# EAGLE design RedFive (EAGLE 9.1.0)

## Sheet 1 of 2
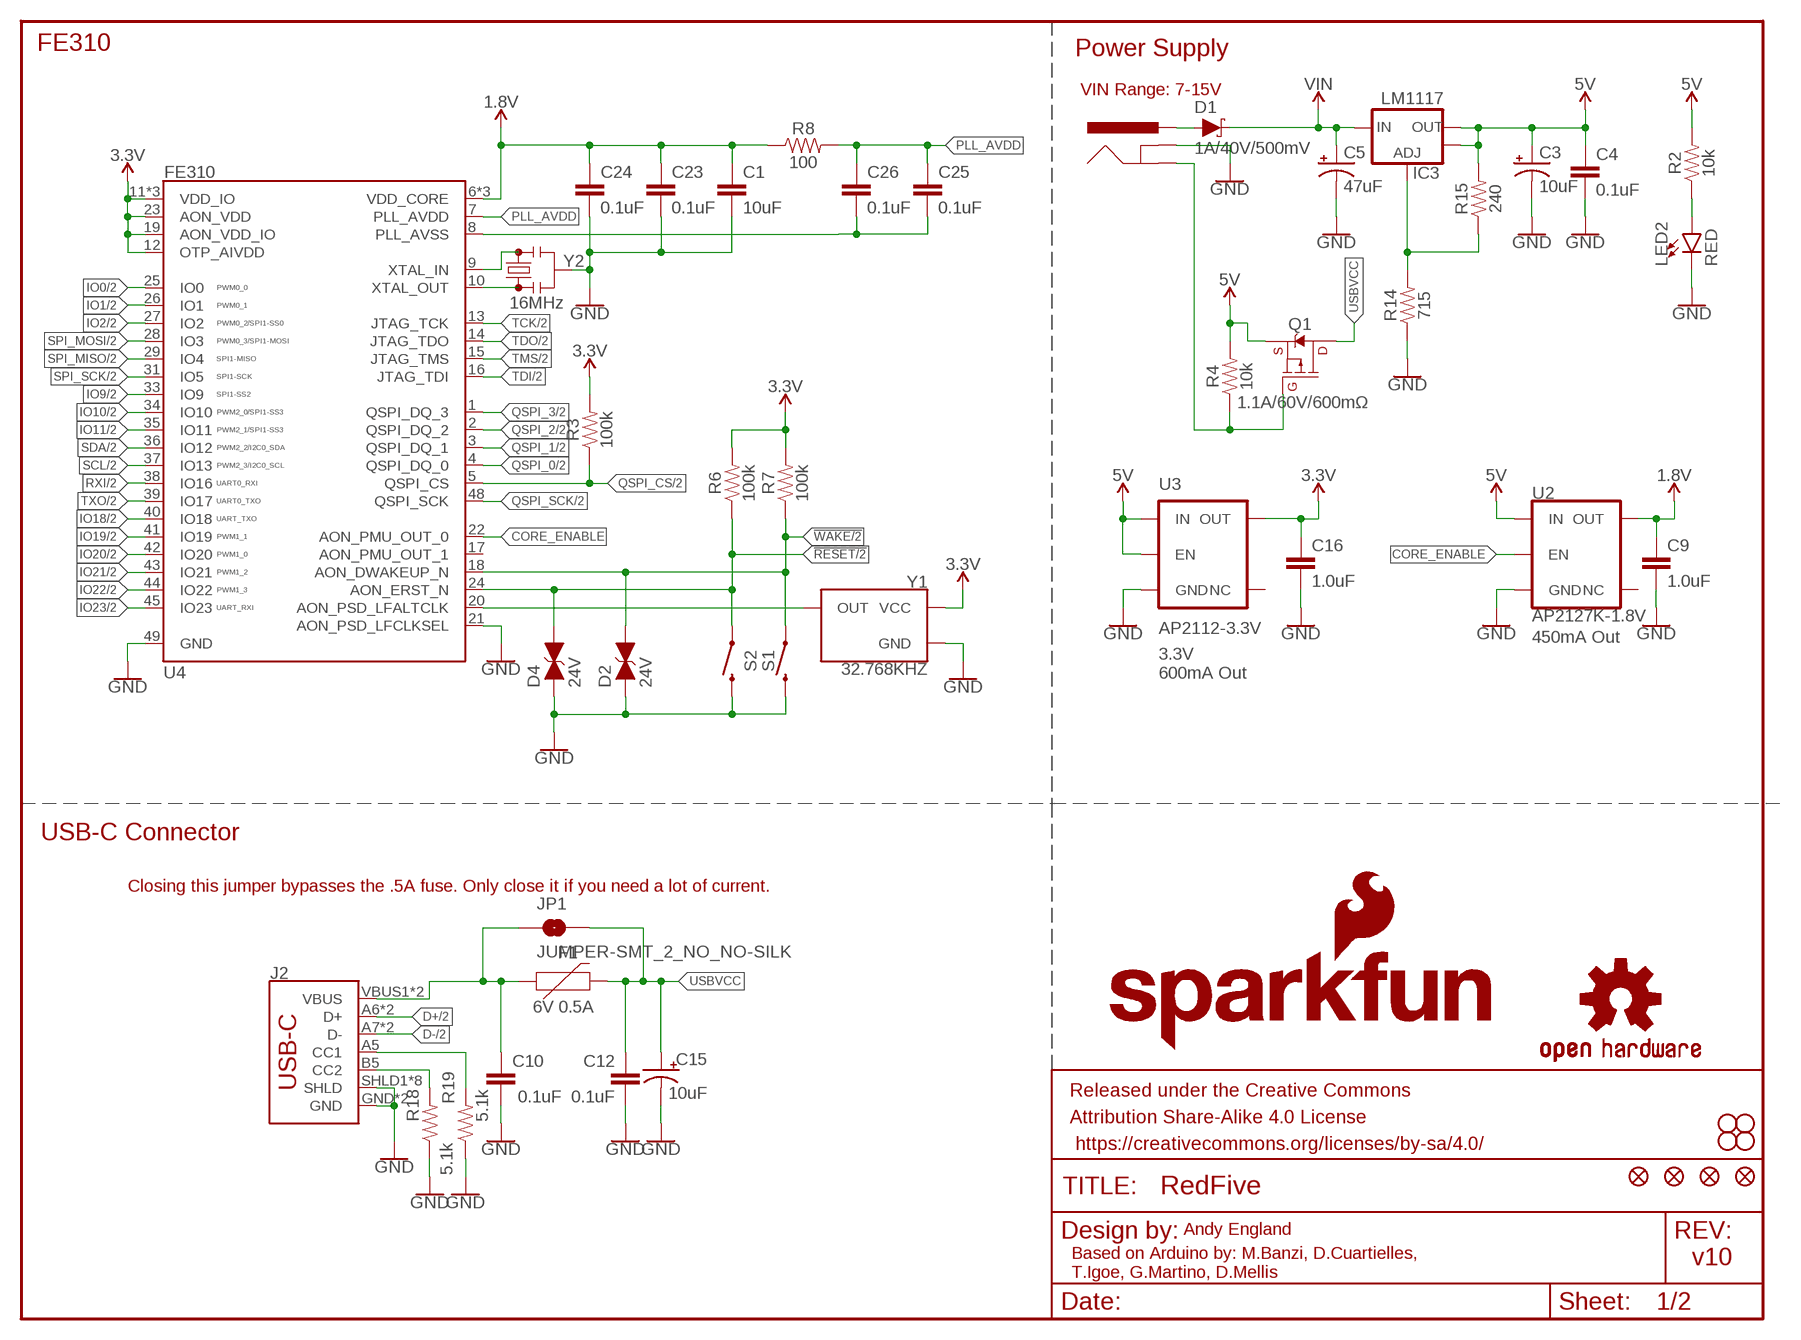
[diagram p0: schematic, sheet 1]

### Parts
C1  10uF  10UF-0603-6.3V-20%  [0603]
C3  10uF  10UF-POLAR-EIA3216-16V-10%(TANT)  [EIA3216]
C4  0.1uF  0.1UF-0603-25V-(+80/-20%)  [0603]
C5  47uF  47UF-POLAR-PANASONIC_D-35V-20%  [PANASONIC_D]
C9  1.0uF  1.0UF-0603-16V-10%  [0603]
C10  0.1uF  0.1UF-0603-25V-(+80/-20%)  [0603]
C12  0.1uF  0.1UF-0603-25V-(+80/-20%)  [0603]
C15  10uF  10UF-POLAR-EIA3216-16V-10%(TANT)  [EIA3216]
C16  1.0uF  1.0UF-0603-16V-10%  [0603]
C23  0.1uF  0.1UF-0603-25V-(+80/-20%)  [0603]
C24  0.1uF  0.1UF-0603-25V-(+80/-20%)  [0603]
C25  0.1uF  0.1UF-0603-25V-(+80/-20%)  [0603]
C26  0.1uF  0.1UF-0603-25V-(+80/-20%)  [0603]
D1  1A/40V/500mV  DIODE-SCHOTTKY-SS14  [SMA-DIODE]
D2  24V  DIODE_TVS  [0603]
D4  24V  DIODE_TVS  [0603]
F1  6V 0.5A  PPTC_6V500MA  [0805]
FRAME2  FRAME-LETTER  [CREATIVE_COMMONS]
IC3  LM1117  V_REG_LM1117ALT1  [SOT223-ALT1]
J2  USB Female Type C Connector  USB_C2-LAYER  [USB-C-16P]
J3  POWER_JACKSUPER_BOMB_DIGITY  [POWER_JACK_SMD_OVERPASTE_SUPER_BOMB_DIGITY]
JP1  JUMPER-SMT_2_NO_NO-SILK  [SMT-JUMPER_2_NO_NO-SILK]
JP3  STAND-OFF  [STAND-OFF]
JP4  STAND-OFF  [STAND-OFF]
JP5  STAND-OFF  [STAND-OFF]
JP6  STAND-OFF  [STAND-OFF]
JP8  FIDUCIAL1X2  [FIDUCIAL-1X2]
JP9  FIDUCIAL1X2  [FIDUCIAL-1X2]
JP15  FIDUCIAL1X2  [FIDUCIAL-1X2]
JP16  FIDUCIAL1X2  [FIDUCIAL-1X2]
LED2  RED  LED-RED1206  [LED-1206]
LOGO1  SFE_LOGO_NAME_FLAME.1_INCH  [SFE_LOGO_NAME_FLAME_.1]
Q1  1.1A/60V/600mΩ  MOSFET_PCH-SI2309DS  [SOT23-3]
R2  10k  10KOHM-0603-1/10W-1%  [0603]
R3  100k  100KOHM-0603-1/10W-1%  [0603]
R4  10k  10KOHM-0603-1/10W-1%  [0603]
R6  100k  100KOHM-0603-1/10W-1%  [0603]
R7  100k  100KOHM-0603-1/10W-1%  [0603]
R8  100  100OHM-0603-1/10W-1%  [0603]
R14  715  715OHM-0603-1/10W-1%  [0603]
R15  240  240OHM-0603-1/10W-1%  [0603]
R18  5.1k  5.1KOHM5.1KOHM-0603-1/10W-1%  [0603]
R19  5.1k  5.1KOHM5.1KOHM-0603-1/10W-1%  [0603]
S1  MOMENTARY-SWITCH-SPST-SMD-6.2MM-TALL  [TACTILE_SWITCH_SMD_6.2MM_TALL]
S2  MOMENTARY-SWITCH-SPST-SMD-6.2MM-TALL  [TACTILE_SWITCH_SMD_6.2MM_TALL]
U2  AP2127K-1.8V  V_REG_AP2127K-1.8V  [SOT23-5]
U3  AP2112-3.3V  V_REG_AP2112K-3.3V  [SOT23-5]
U4  FE310  SIFIVE_FE310  [QFN-48-.4MMPITCH]
U$16  OSHW-LOGOS  [OSHW-LOGO-S]
Y1  32.768KHZ  SITIME-CRYSTAL-32.768KHZ  [CRYSTAL-SMD-2X1.2MM]
Y2  16MHz  RESONATOR-16MHZSMD_3.2X1.3  [RESONATOR-SMD-3.2X1.3]

### Nets
1.8V: C1.1 C9.1 C23.1 C24.1 R8.1 U2.5(OUT) U4.6(VDD_CORE) U4.30(VDD_CORE) U4.46(VDD_CORE)
3.3V: C16.1 R3.2 R6.2 R7.2 U3.5(OUT) U4.11(VDD_IO) U4.12(OTP_AIVDD) U4.19(AON_VDD_IO) U4.23(AON_VDD) U4.32(VDD_IO) U4.47(VDD_IO) Y1.4(VCC) ; also sheet 2
5V: C3.+ C4.1 IC3.2(OUT) IC3.4(OUT) Q1.2(S) R2.2 R4.2 R15.2 U2.1(IN) U3.1(IN) U3.3(EN) ; also sheet 2
!RESET: D4.2(C) R6.1 S2.A2 U4.24(AON_ERST_N) ; also sheet 2
!WAKE: D2.2(C) R7.1 S1.A2 U4.18(AON_DWAKEUP_N) ; also sheet 2
CORE_ENABLE: U2.3(EN) U4.22(AON_PMU_OUT_0)
D+: J2.A6(D+) J2.B6(D+) ; also sheet 2
D-: J2.A7(D-) J2.B7(D-) ; also sheet 2
GND: C1.2 C3.- C4.2 C5.- C9.2 C10.2 C12.2 C15.- C16.2 C23.2 C24.2 D2.1(A) D4.1(A) J2.GND J2.GND2(GND) J2.SHLD1(SHLD) J2.SHLD2(SHLD) J2.SHLD3(SHLD) J2.SHLD4(SHLD) J2.SHLD5(SHLD) J2.SHLD6(SHLD) J2.SHLD7(SHLD) J2.SHLD8(SHLD) J3.GND(GNDBREAK) LED2.C R14.1 R18.1 R19.1 S1.B2 S2.B2 U2.2(GND) U3.2(GND) U4.21(AON_PSD_LFCLKSEL) U4.49(GND) Y1.2(GND) Y2.2 ; also sheet 2
INSERT: J3.P$4(GND) Q1.1(G) R4.1
IO0: U4.25(IO0) ; also sheet 2
IO1: U4.26(IO1) ; also sheet 2
IO2: U4.27(IO2) ; also sheet 2
IO9: U4.33(IO9) ; also sheet 2
IO10: U4.34(IO10) ; also sheet 2
IO11: U4.35(IO11) ; also sheet 2
IO18: U4.40(IO18) ; also sheet 2
IO19: U4.41(IO19) ; also sheet 2
IO20: U4.42(IO20) ; also sheet 2
IO21: U4.43(IO21) ; also sheet 2
IO22: U4.44(IO22) ; also sheet 2
IO23: U4.45(IO23) ; also sheet 2
N$2: LED2.A R2.1
N$3: U4.10(XTAL_OUT) Y2.1
N$7: U4.9(XTAL_IN) Y2.3
N$8: U4.20(AON_PSD_LFALTCLK) Y1.3(OUT)
N$10: C25.2 C26.2 U4.8(PLL_AVSS)
N$12: J2.B5(CC2) R18.2
N$15: IC3.1(ADJ) R14.2 R15.1
N$17: J2.A5(CC1) R19.2
PLL_AVDD: C25.1 C26.1 R8.2 U4.7(PLL_AVDD)
PWRIN: D1.A J3.VIN0(PWR)
QSPI_0: U4.4(QSPI_DQ_0) ; also sheet 2
QSPI_1: U4.3(QSPI_DQ_1) ; also sheet 2
QSPI_2: U4.2(QSPI_DQ_2) ; also sheet 2
QSPI_3: U4.1(QSPI_DQ_3) ; also sheet 2
QSPI_CS: R3.1 U4.5(QSPI_CS) ; also sheet 2
QSPI_SCK: U4.48(QSPI_SCK) ; also sheet 2
RXI: U4.38(IO16) ; also sheet 2
SCL: U4.37(IO13) ; also sheet 2
SDA: U4.36(IO12) ; also sheet 2
SPI_MISO: U4.29(IO4) ; also sheet 2
SPI_MOSI: U4.28(IO3) ; also sheet 2
SPI_SCK: U4.31(IO5) ; also sheet 2
TCK: U4.13(JTAG_TCK) ; also sheet 2
TDI: U4.16(JTAG_TDI) ; also sheet 2
TDO: U4.14(JTAG_TDO) ; also sheet 2
TMS: U4.15(JTAG_TMS) ; also sheet 2
TXO: U4.39(IO17) ; also sheet 2
USBVCC: C12.1 C15.+ F1.2 JP1.2 Q1.3(D)
VIN: C5.+ D1.C IC3.3(IN) ; also sheet 2
VUSB: C10.1 F1.1 J2.VBUS1(VBUS) J2.VBUS2(VBUS) JP1.1
Unconnected: U2.4(NC) U3.4(NC) U4.17(AON_PMU_OUT_1)

### Notes on the sheet
- FE310 | Power Supply
- VIN Range: 7-15V
- 450mA Out
- 3.3V
  600mA Out
- USB-C Connector
- Closing this jumper bypasses the .5A fuse. Only close it if you need a lot of current.
- Andy England
- v10
- Based on Arduino by: M.Banzi, D.Cuartielles, 
  T.Igoe, G.Martino, D.Mellis

## Sheet 2 of 2
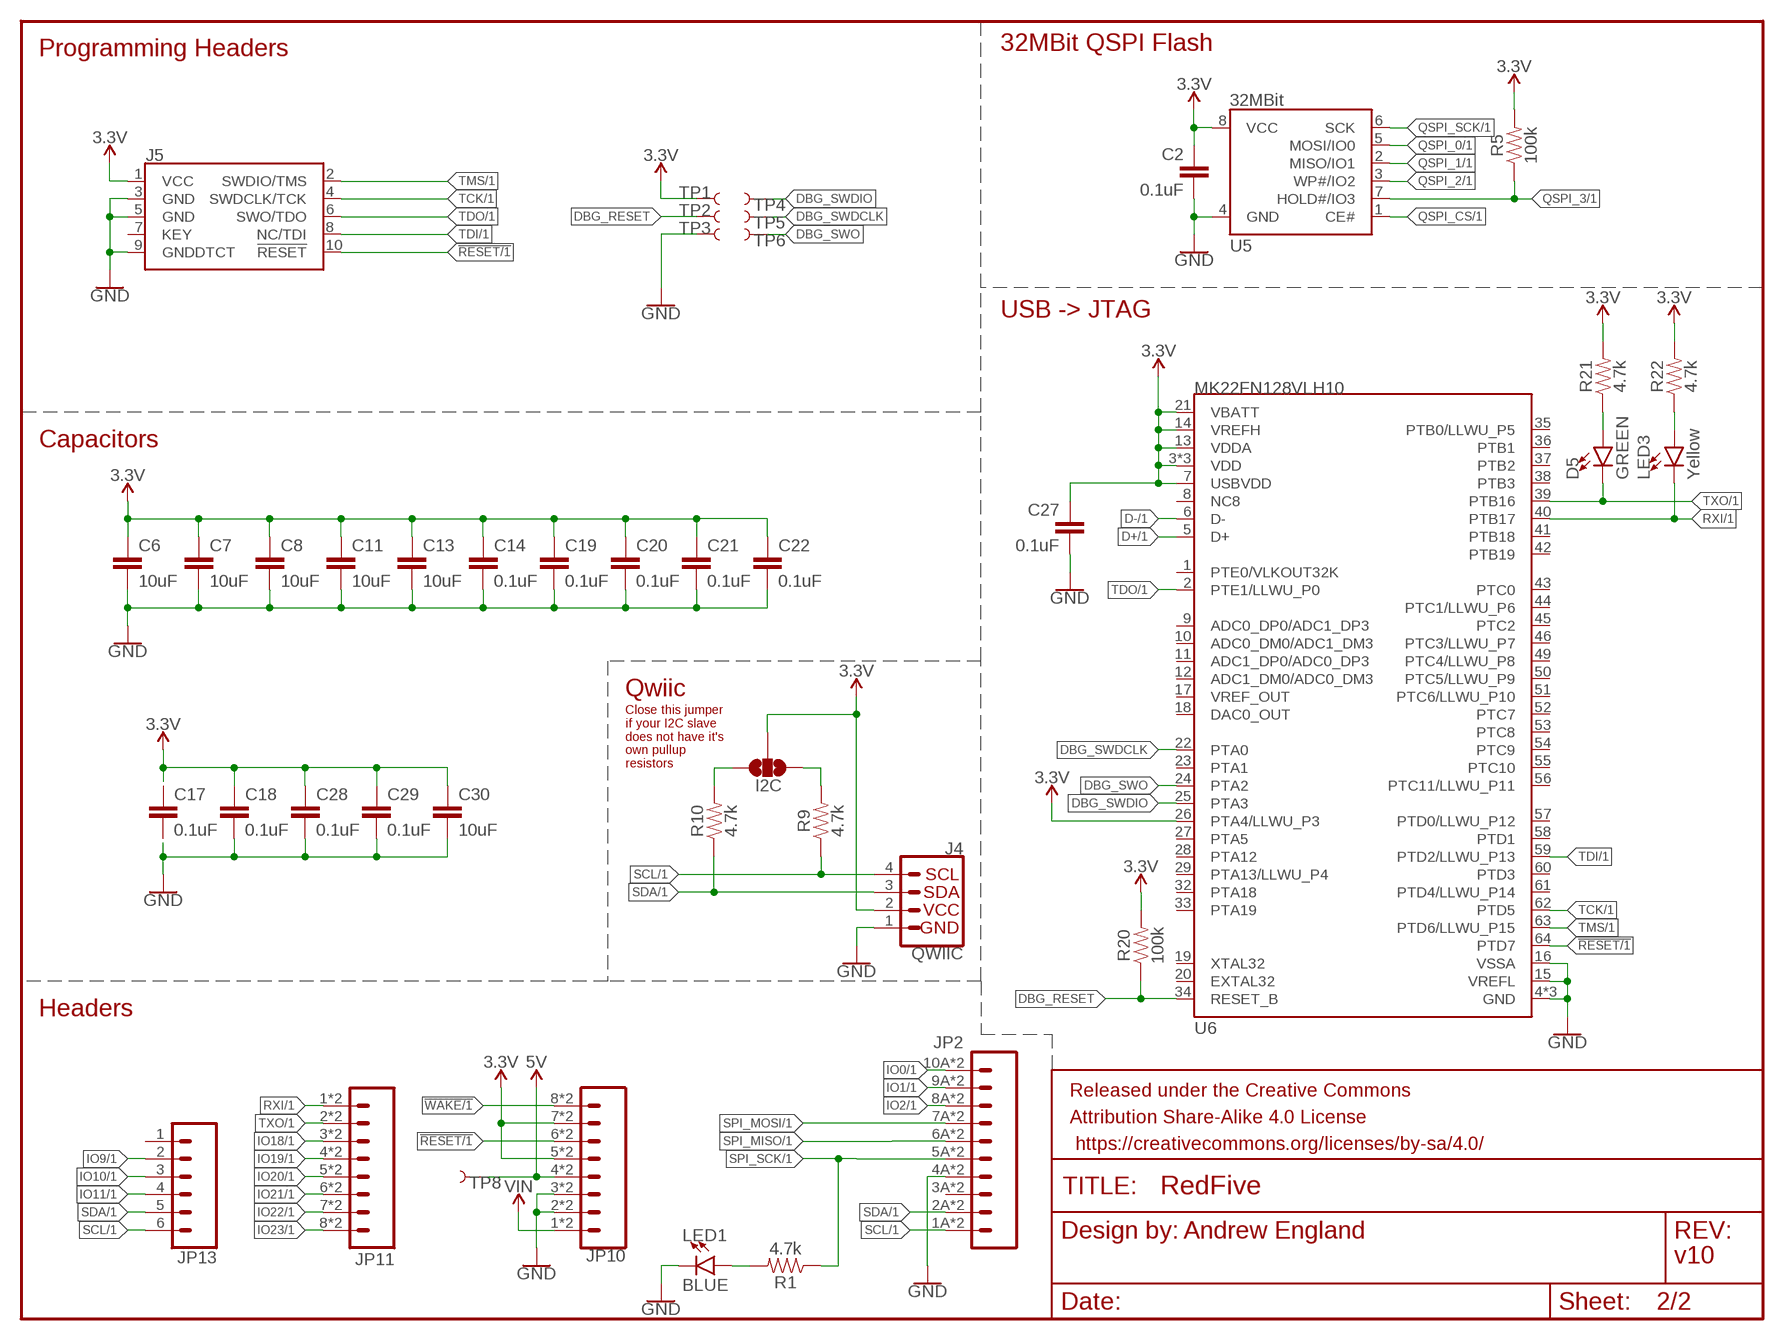
[diagram p1: schematic, sheet 2]

### Parts
C2  0.1uF  0.1UF-0603-25V-(+80/-20%)  [0603]
C6  10uF  10UF-0603-6.3V-20%  [0603]
C7  10uF  10UF-0603-6.3V-20%  [0603]
C8  10uF  10UF-0603-6.3V-20%  [0603]
C11  10uF  10UF-0603-6.3V-20%  [0603]
C13  10uF  10UF-0603-6.3V-20%  [0603]
C14  0.1uF  0.1UF-0603-25V-(+80/-20%)  [0603]
C17  0.1uF  0.1UF-0603-25V-(+80/-20%)  [0603]
C18  0.1uF  0.1UF-0603-25V-(+80/-20%)  [0603]
C19  0.1uF  0.1UF-0603-25V-(+80/-20%)  [0603]
C20  0.1uF  0.1UF-0603-25V-(+80/-20%)  [0603]
C21  0.1uF  0.1UF-0603-25V-(+80/-20%)  [0603]
C22  0.1uF  0.1UF-0603-25V-(+80/-20%)  [0603]
C27  0.1uF  0.1UF-0603-25V-(+80/-20%)  [0603]
C28  0.1uF  0.1UF-0603-25V-(+80/-20%)  [0603]
C29  0.1uF  0.1UF-0603-25V-(+80/-20%)  [0603]
C30  10uF  10UF-0603-6.3V-20%  [0603]
D5  GREEN  LED-GREENLILYPAD  [LED-1206]
FRAME1  FRAME-LETTER  [CREATIVE_COMMONS]
I2C  JUMPER-SMT_3_NO_NO-SILK  [SMT-JUMPER_3_NO_NO-SILK]
J4  QWIIC  QWIIC_CONNECTORJS-1MM  [JST04_1MM_RA]
J5  CORTEX_JTAG_DEBUG_PTH_NS  [2X5-PTH-1.27MM-NO_SILK]
JP2  CONN_10SMD_COMBO-FEMALE  [1X10_SMD_COMBINED]
JP10  CONN_08SMD-COMBO-FEMALE  [1X08_SMD_COMBINED]
JP11  JP11  CONN_08SMD-COMBO-FEMALE  [1X08_SMD_COMBINED]
JP13  CONN_06SMD-STRAIGHT-COMBO-FEMALE  [1X06_SMD_STRAIGHT_COMBO]
LED1  BLUE  LED-BLUE1206  [LED-1206]
LED3  Yellow  LED-YELLOWLILYPAD  [LED-1206]
R1  4.7k  4.7KOHM-0603-1/10W-1%  [0603]
R5  100k  100KOHM-0603-1/10W-1%  [0603]
R9  4.7k  4.7KOHM-0603-1/10W-1%  [0603]
R10  4.7k  4.7KOHM-0603-1/10W-1%  [0603]
R20  100k  100KOHM-0603-1/10W-1%  [0603]
R21  4.7k  4.7KOHM-0603-1/10W-1%  [0603]
R22  4.7k  4.7KOHM-0603-1/10W-1%  [0603]
TP1  TEST-POINT3X5  [PAD.03X.05]
TP2  TEST-POINT3X5  [PAD.03X.05]
TP3  TEST-POINT3X5  [PAD.03X.05]
TP4  TEST-POINT3X5  [PAD.03X.05]
TP5  TEST-POINT3X5  [PAD.03X.05]
TP6  TEST-POINT3X5  [PAD.03X.05]
TP8  TEST-POINT3  [PAD.03X.03]
U5  32MBit  QSPI32MBIT  [SO08]
U6  MK22FN128VLH10  [LQFP-64]

### Nets
3.3V: C2.1 C6.1 C7.1 C8.1 C11.1 C13.1 C14.1 C17.1 C18.1 C19.1 C20.1 C21.1 C22.1 C27.1 C28.1 C29.1 C30.1 I2C.2 J4.2 J5.1(VCC) JP10.5 JP10.5@2 JP10.7 JP10.7@2 R5.2 R20.2 R21.2 R22.2 TP1.P$1 U5.8(VCC) U6.3(VDD) U6.7(USBVDD) U6.13(VDDA) U6.14(VREFH) U6.21(VBATT) U6.26(PTA4/LLWU_P3) U6.30(VDD) U6.48(VDD) ; also sheet 1
5V: JP10.4 JP10.4@2 TP8.P$1 ; also sheet 1
!RESET: J5.10(!RESET) JP10.6 JP10.6@2 U6.64(PTD7) ; also sheet 1
!WAKE: JP10.8 JP10.8@2 ; also sheet 1
D+: U6.5(D+) ; also sheet 1
D-: U6.6(D-) ; also sheet 1
DBG_RESET: R20.1 TP2.P$1 U6.34(RESET_B)
DBG_SWDCLK: TP5.P$1 U6.22(PTA0)
DBG_SWDIO: TP4.P$1 U6.25(PTA3)
DBG_SWO: TP6.P$1 U6.24(PTA2)
GND: C2.2 C6.2 C7.2 C8.2 C11.2 C13.2 C14.2 C17.2 C18.2 C19.2 C20.2 C21.2 C22.2 C27.2 C28.2 C29.2 C30.2 J4.1 J5.3(GND) J5.5(GND) J5.9(GNDDTCT) JP2.4A JP2.4B JP10.2 JP10.2@2 JP10.3 JP10.3@2 LED1.C TP3.P$1 U5.4(GND) U6.4(GND) U6.15(VREFL) U6.16(VSSA) U6.31(GND) U6.47(GND) ; also sheet 1
IO0: JP2.10A JP2.10B ; also sheet 1
IO1: JP2.9A JP2.9B ; also sheet 1
IO2: JP2.8A JP2.8B ; also sheet 1
IO9: JP13.2 ; also sheet 1
IO10: JP13.3 ; also sheet 1
IO11: JP13.4 ; also sheet 1
IO18: JP11.3 JP11.3@2 ; also sheet 1
IO19: JP11.4 JP11.4@2 ; also sheet 1
IO20: JP11.5 JP11.5@2 ; also sheet 1
IO21: JP11.6 JP11.6@2 ; also sheet 1
IO22: JP11.7 JP11.7@2 ; also sheet 1
IO23: JP11.8 JP11.8@2 ; also sheet 1
N$1: LED1.A R1.2
N$4: I2C.3 R10.2
N$5: I2C.1 R9.2
N$6: LED3.A R22.1
N$13: D5.A R21.1
QSPI_0: U5.5(MOSI/IO0) ; also sheet 1
QSPI_1: U5.2(MISO/IO1) ; also sheet 1
QSPI_2: U5.3(WP#/IO2) ; also sheet 1
QSPI_3: R5.1 U5.7(HOLD#/IO3) ; also sheet 1
QSPI_CS: U5.1(CE#) ; also sheet 1
QSPI_SCK: U5.6(SCK) ; also sheet 1
RXI: JP11.1 JP11.1@2 LED3.C U6.40(PTB17) ; also sheet 1
SCL: J4.4 JP2.1A JP2.1B JP13.6 R9.1 ; also sheet 1
SDA: J4.3 JP2.2A JP2.2B JP13.5 R10.1 ; also sheet 1
SPI_MISO: JP2.6A JP2.6B ; also sheet 1
SPI_MOSI: JP2.7A JP2.7B ; also sheet 1
SPI_SCK: JP2.5A JP2.5B R1.1 ; also sheet 1
TCK: J5.4(SWDCLK/TCK) U6.62(PTD5) ; also sheet 1
TDI: J5.8(NC/TDI) U6.59(PTD2/LLWU_P13) ; also sheet 1
TDO: J5.6(SWO/TDO) U6.2(PTE1/LLWU_P0) ; also sheet 1
TMS: J5.2(SWDIO/TMS) U6.63(PTD6/LLWU_P15) ; also sheet 1
TXO: D5.C JP11.2 JP11.2@2 U6.39(PTB16) ; also sheet 1
VIN: JP10.1 JP10.1@2 ; also sheet 1
Unconnected: J5.7(KEY) JP2.3A JP2.3B JP13.1 U6.1(PTE0/VLKOUT32K) U6.8(NC8) U6.9(ADC0_DP0/ADC1_DP3) U6.10(ADC0_DM0/ADC1_DM3) U6.11(ADC1_DP0/ADC0_DP3) U6.12(ADC1_DM0/ADC0_DM3) U6.17(VREF_OUT) U6.18(DAC0_OUT) U6.19(XTAL32) U6.20(EXTAL32) U6.23(PTA1) U6.27(PTA5) U6.28(PTA12) U6.29(PTA13/LLWU_P4) U6.32(PTA18) U6.33(PTA19) U6.35(PTB0/LLWU_P5) U6.36(PTB1) U6.37(PTB2) U6.38(PTB3) U6.41(PTB18) U6.42(PTB19) U6.43(PTC0) U6.44(PTC1/LLWU_P6) U6.45(PTC2) U6.46(PTC3/LLWU_P7) U6.49(PTC4/LLWU_P8) U6.50(PTC5/LLWU_P9) U6.51(PTC6/LLWU_P10) U6.52(PTC7) U6.53(PTC8) U6.54(PTC9) U6.55(PTC10) U6.56(PTC11/LLWU_P11) U6.57(PTD0/LLWU_P12) U6.58(PTD1) U6.60(PTD3) U6.61(PTD4/LLWU_P14)

### Notes on the sheet
- Programming Headers | 32MBit QSPI Flash
- USB -> JTAG
- Capacitors
- Qwiic
- Close this jumper 
  if your I2C slave 
  does not have it's
  own pullup 
  resistors
- Headers
- Andrew England
- v10

## Library data of the parts
C1 C6-C8 C11 C13 C30 = SparkFun-Capacitors:10UF: 10.0µF ceramic capacitors A capacitor is a passive two-terminal electrical component used to store electrical energy temporarily in an electric field.; PROD_ID: CAP-11015
C2 C4 C10 C12 C14 C17-C29 = SparkFun-Capacitors:0.1UF: 0.1µF ceramic capacitors A capacitor is a passive two-terminal electrical component used to store electrical energy temporarily in an electric field.; PROD_ID: CAP-00810
C3 C15 = SparkFun-Capacitors:10UF-POLAR: 10.0µF polarized capacitors A capacitor is a passive two-terminal electrical component used to store electrical energy temporarily in an electric field.; PROD_ID: CAP-00811
C5 = SparkFun-Capacitors:47UF-POLAR: 47µF polarized capacitors A capacitor is a passive two-terminal electrical component used to store electrical energy temporarily in an electric field.; PROD_ID: CAP-08478
C9 C16 = SparkFun-Capacitors:1.0UF: 1µF ceramic capacitors A capacitor is a passive two-terminal electrical component used to store electrical energy temporarily in an electric field.; PROD_ID: CAP-00868
D1 = SparkFun-DiscreteSemi:DIODE-SCHOTTKY: Schottky diode A Schottky diode is a semiconductor diode which has a low forward voltage drop and a very fast switching action.; PROD_ID: DIO-08053
D2 D4 = SparkFun-DiscreteSemi:DIODE_TVS; PROD_ID: DIO-14502
D5 = SparkFun-LED:LED-GREEN: Green SMD LED Used in manufacturing of various products at SparkFun Packages: 0603 - SMD 0603 package [Product Link] <http://www.futureelectronics.com/en/technologies/semiconductors/optoelectronics/leds/Pages/9894312-LTST-C190GKT.aspx?CrossPart=HSMG-C190&IM=0> LilyPad 1206 - SMD1206 LilyPad package [Product Link] <http://www.futureelectronics.com/en/Technologies/Product.aspx?ProductID=IN150NGHARVATEKCORPORATION2049943&IM=0> 1206 - SMD1206 package [Product Link] <http://www.futureelectronics.com/en/technologies/semiconductors/optoelectronics/leds/Pages/8315665-LTST-C150KGKT.aspx?IM=0> 1206 Bottom Mount -SMD 1206 Bottom Mount [Product Link] <http://www.digikey.com/product-detail/en/lite-on-inc/LTST-C230KGKT/160-1456-1-ND/386854> SparkFun Products: Pro Mini 328 -5V <https://www.sparkfun.com/products/821> RedBoard <https://www.sparkfun.com/products/12757> MP3 Trigger <https://www.sparkfun.com/products/13720> Makey Makey <https://www.sparkfun.com/products/11076>; PROD_ID: DIO-09910
F1 = SparkFun-Fuses:PPTC: Resettable Fuse PPTC Resettable Fuse. Really a sort of resistor with a polymeric positive temperature coefficient whose resistance increases dramatically with an increase in temperature. When heated by the power passing through the resistance rises causing the current to be limited, protecting the circuit. This is achieved by the transition of the polymer from a crystalline to an amorphous state where the conductive carbon separates breaking the conductive pathways found in the cool crystalline structure. When a PPTC cools back down it resumes conducting letting the circuit turn back on. SparkFun Products: SparkFun RedBoard - Programmed with Arduino <https://www.sparkfun.com/products/12757> Pro Micro - 5V/16MHz <https://www.sparkfun.com/products/12640> Arduino Pro 328 - 5V/16MHz <https://www.sparkfun.com/products/10915> MP3 Trigger <https://www.sparkfun.com/products/13720>; PROD_ID: RES-13945
FRAME1 FRAME2 = SparkFun-Aesthetics:FRAME-LETTER: Schematic Frame - Letter Standard 8.5x11 US Letter frame
I2C = SparkFun-Jumpers:JUMPER-SMT_3_NO: Normally open jumper This jumper has three pads in close proximity to each other. Apply solder to close the connection(s).
IC3 = Testing:V_REG_LM1117: Voltage Regulator LM1117 Standard adjustable voltage regulator but in SMD form. Spark Fun Electronics SKU : COM-00595; PROD_ID: VREG-08170
J2 = SparkFun-Connectors:USB_C: USB Type C 16Pin Connector Super Speed pins not available on the 16-pin purely SMD connector so this part is best for USB 2.0 implementations. D1 and D2 are tied together enabling D+/- no matter which way the cable is plugged into the connector. The two channel configuration pins (CC1/2) are exposed. These are normally connected to ground via 5.1k resistors but can be reconfigured for high current/high power applications.; PROD_ID: CONN-14122
J3 = Testing:POWER_JACK: Power Jack This is the standard 5.5mm barrel jack for power. The PTH is the most common, proven, reliable, footprint. All others are experimental. The Slot footprint only works if the mill layer is transmitted to the PCB fab house so be warned. Spark Fun Electronics SKU : PRT-00119. Mating wall wart : TOL-00298 (and others); PROD_ID: CONN-08106
J4 = SparkFun-Connectors:QWIIC_CONNECTOR: SparkFun I2C Standard Qwiic Connector An SMD 1mm pitch JST connector makes it easy and quick (get it? Qwiic?) to connect I2C devices to each other. The Qwiic system <http://www.sparkfun.com/qwiic> enables fast and solderless connection between popular platforms and various sensors and actuators. We carry 200mm <https://www.sparkfun.com/products/14204>, 100mm <https://www.sparkfun.com/products/14205>, 50mm <https://www.sparkfun.com/products/14206>, and breadboard friendly <https://www.sparkfun.com/products/14207> Qwiic cables. We also offer 10 pcs strips <https://www.sparkfun.com/products/14323> the SMD connectors.; PROD_ID: CONN-13694; VALUE: QWIIC_RIGHT_ANGLE
J5 = SparkFun-Connectors:CORTEX_JTAG_DEBUG: Cortex Debug Connector - 10 pin Supports JTAG debug, Serial Wire debug, and Serial Wire Viewer. PTH and SMD connector options available. General Connector Information <http://infocenter.arm.com/help/topic/com.arm.doc.faqs/attached/13634/cortex_debug_connectors.pdf> Products: PTH Connector <http://www.digikey.com/product-detail/en/cnc-tech/3220-10-0100-00/1175-1627-ND/3883661> -via Digi-Key SparkFun PSoc <https://www.sparkfun.com/products/13229> SparkFun T <https://www.sparkfun.com/products/13810>
JP1 = SparkFun-Jumpers:JUMPER-SMT_2_NO: Normally open jumper This jumper has two pads in close proximity to each other. Apply solder to close the connection. Round pads are easier to solder for beginners, but are a lot larger. SparkFun Product that uses the round pads: SparkFun EL Sequencer <https://www.sparkfun.com/products/12781>
JP2 = SparkFun-Connectors:CONN_10: Multi connection point. Often used as Generic Header-pin footprint for 0.1 inch spaced/style header connections On any of the 0.1 inch spaced packages, you can populate with these: Break Away Headers - Straight <https://www.sparkfun.com/products/116> (PRT-00116) Break Away Male Headers - Right Angle <https://www.sparkfun.com/products/553> (PRT-00553) Female Headers <https://www.sparkfun.com/products/115> (PRT-00115) Break Away Headers - Machine Pin <https://www.sparkfun.com/products/117> (PRT-00117) Break Away Female Headers - Swiss Machine Pin <https://www.sparkfun.com/products/743> (PRT-00743) Arduino Stackable Header - 10 Pin <https://www.sparkfun.com/products/11376> (PRT-11376) For SCREWTERMINALS and SPRING TERMINALS visit here: Screw Terimnals on SparkFun.com <https://www.sparkfun.com/search/results?term=Screw+Terminals> (5mm/3.5mm/2.54mm spacing) This device is also useful as a general connection point to wire up your design to another part of your project. Our various solder wires solder well into these plated through hole pads. Hook-Up Wire - Assortment (Stranded, 22 AWG) <https://www.sparkfun.com/products/11375> (PRT-11375) Hook-Up Wire - Assortment (Solid Core, 22 AWG) <https://www.sparkfun.com/products/11367> (PRT-11367) View the entire wire category on our website here <https://www.sparkfun.com/categories/141> Special notes: Molex polarized connector foot print use with SKU : PRT-08231 with associated crimp pins and housings. 1MM SMD Version SKU: PRT-10208 NOTES ON THE VARIANTS LOCK and LOCK_LONGPADS... This footprint was designed to help hold the alignment of a through-hole component (i.e. 6-pin header) while soldering it into place. You may notice that each hole has been shifted either up or down by 0.005 of an inch from it's more standard position (which is a perfectly straight line). This slight alteration caused the pins (the squares in the middle) to touch the edges of the holes. Because they are alternating, it causes a "brace" to hold the component in place. 0.005 has proven to be the perfect amount of "off-center" position when using our standard breakaway headers. Although looks a little odd when you look at the bare footprint, once you have a header in there, the alteration is very hard to notice. Also,if you push a header all the way into place, it is covered up entirely on the bottom side.; PROD_ID: CONN-11219
JP3-JP6 = SparkFun:STAND-OFF: Stand Off This is the mechanical footprint for a #4 phillips button head screw. Use the keepout ring to avoid running the screw head into surrounding components. SKU : PRT-00447
JP8 JP9 JP15 JP16 = SparkFun:FIDUCIAL: Fiducial Alignment Points Various fiducial points for machine vision alignment.
JP10 JP11 = SparkFun-Connectors:CONN_08: Multi connection point. Often used as Generic Header-pin footprint for 0.1 inch spaced/style header connections On any of the 0.1 inch spaced packages, you can populate with these: Break Away Headers - Straight <https://www.sparkfun.com/products/116> (PRT-00116) Break Away Male Headers - Right Angle <https://www.sparkfun.com/products/553> (PRT-00553) Female Headers <https://www.sparkfun.com/products/115> (PRT-00115) Break Away Headers - Machine Pin <https://www.sparkfun.com/products/117> (PRT-00117) Break Away Female Headers - Swiss Machine Pin <https://www.sparkfun.com/products/743> (PRT-00743) Arduino Stackable Header - 8 Pin <https://www.sparkfun.com/products/9279> (PRT-09279) For SCREWTERMINALS and SPRING TERMINALS visit here: Screw Terimnals on SparkFun.com <https://www.sparkfun.com/search/results?term=Screw+Terminals> (5mm/3.5mm/2.54mm spacing) This device is also useful as a general connection point to wire up your design to another part of your project. Our various solder wires solder well into these plated through hole pads. Hook-Up Wire - Assortment (Stranded, 22 AWG) <https://www.sparkfun.com/products/11375> (PRT-11375) Hook-Up Wire - Assortment (Solid Core, 22 AWG) <https://www.sparkfun.com/products/11367> (PRT-11367) View the entire wire category on our website here <https://www.sparkfun.com/categories/141> Special notes: Molex polarized connector foot print use with SKU : PRT-08231 with associated crimp pins and housings. 1MM SMD Version SKU: PRT-10208 NOTES ON THE VARIANTS LOCK and LOCK_LONGPADS... This footprint was designed to help hold the alignment of a through-hole component (i.e. 6-pin header) while soldering it into place. You may notice that each hole has been shifted either up or down by 0.005 of an inch from it's more standard position (which is a perfectly straight line). This slight alteration caused the pins (the squares in the middle) to touch the edges of the holes. Because they are alternating, it causes a "brace" to hold the component in place. 0.005 has proven to be the perfect amount of "off-center" position when using our standard breakaway headers. Although looks a little odd when you look at the bare footprint, once you have a header in there, the alteration is very hard to notice. Also,if you push a header all the way into place, it is covered up entirely on the bottom side.; PROD_ID: CONN-10204; SF_ID: PRT-11543
JP13 = SparkFun-Connectors:CONN_06: Multi connection point. Often used as Generic Header-pin footprint for 0.1 inch spaced/style header connections On any of the 0.1 inch spaced packages, you can populate with these: Break Away Headers - Straight <https://www.sparkfun.com/products/116> (PRT-00116) Break Away Male Headers - Right Angle <https://www.sparkfun.com/products/553> (PRT-00553) Female Headers <https://www.sparkfun.com/products/115> (PRT-00115) Break Away Headers - Machine Pin <https://www.sparkfun.com/products/117> (PRT-00117) Break Away Female Headers - Swiss Machine Pin <https://www.sparkfun.com/products/743> (PRT-00743) Arduino Stackable Header - 6 Pin <https://www.sparkfun.com/products/9280> (PRT-09280) For SCREWTERMINALS and SPRING TERMINALS visit here: Screw Terimnals on SparkFun.com <https://www.sparkfun.com/search/results?term=Screw+Terminals> (5mm/3.5mm/2.54mm spacing) This device is also useful as a general connection point to wire up your design to another part of your project. Our various solder wires solder well into these plated through hole pads. Hook-Up Wire - Assortment (Stranded, 22 AWG) <https://www.sparkfun.com/products/11375> (PRT-11375) Hook-Up Wire - Assortment (Solid Core, 22 AWG) <https://www.sparkfun.com/products/11367> (PRT-11367) View the entire wire category on our website here <https://www.sparkfun.com/categories/141>; PROD_ID: CONN-10203
LED1 = SparkFun-LED:LED-BLUE: Blue SMD LED Used in manufacturing of various products at SparkFun Packages: 0603 - SMD 0603 package [Product Link] <http://www.digikey.com/product-detail/en/SMLE12BC7TT86/511-1589-2-ND/1641808> 1206 - SMD1206 package [Product Link] <http://www.digikey.com/product-detail/en/lite-on-inc/LTST-C150TBKT/160-1643-1-ND/573584> SparkFun Products: ESP8266 Thing-Dev Board <https://www.sparkfun.com/products/13711> RedBoard <https://www.sparkfun.com/products/12757>; PROD_ID: DIO-09911
LED2 = SparkFun-LED:LED-RED: Red SMD LED Used in manufacturing of most products at SparkFun Packages: 0603 - SMD 0603 package [Product Link] <http://docs.avagotech.com/docs/AV02-0551EN> 0603 SMART - SMD 0603 SMART package ( more efficient and expensive)[Product Link] <http://www.osram-os.com/Graphics/XPic2/00077099_0.pdf> 1206 - SMD1206 package [Product Link] <https://www.sparkfun.com/datasheets/DevTools/LilyPad/Q150OVS4.pdff> SparkFun Products: Pro Mini 328 -5V <https://www.sparkfun.com/products/821> RedBoard <https://www.sparkfun.com/products/12757> IOIO-OTG <https://www.sparkfun.com/products/13613>; PROD_ID: DIO-09912
LED3 = SparkFun-LED:LED-YELLOW: Yellow SMD LED Used in manufacturing several products at SparkFun. Packages: 0603 - SMD 0603 package[Product Link] <http://www.kingbrightusa.com/product.asp?catalog_name=LED&product_id=APT1608SYCK> 0603 -SMART - SMART SMD 0603 package (more efficient/more expensive) [Product Link] <http://www.osram-os.com/osram_os/en/products/product-catalog/led-light-emitting-diodes/smartled-0603/ly-l29k/index.jsp> LilyPad - SMD1206 package[Product Datasheet] <https://www.sparkfun.com/datasheets/DevTools/LilyPad/Q150YUS4.pdf> SparkFun Products: Blynk Board <https://www.sparkfun.com/products/13794> IOIO-OTG <https://www.sparkfun.com/products/13613> XBee Explorer Serial <https://www.sparkfun.com/products/13225>; PROD_ID: DIO-09909
LOGO1 = SparkFun-Aesthetics:SFE_LOGO_NAME_FLAME: SparkFun Font Logo w/ Flame This is the SparkFun full logo. The logo on the schematic will always be the same size; the package variant is the height of the flame part of the logo. Default layer for the logo on the board is tSilk.
Q1 = SparkFun-DiscreteSemi:MOSFET_PCH: P-channel MOSFETs Voltage controlled devices that allow control of high current outputs. SparkFun Products: SparkFun ESP32 Thing <https://www.sparkfun.com/products/13907> SparkFun ESP8266 Thing <https://www.sparkfun.com/products/13231> SparkFun Pi Servo HAT V2 <https://www.sparkfun.com/products/15316> DMG2305UX-7 (20V/4.2A/SOT23-3); PROD_ID: TRANS-08285
R1 R9 R10 R21 R22 = SparkFun-Resistors:4.7KOHM: 4.7kΩ resistor A resistor is a passive two-terminal electrical component that implements electrical resistance as a circuit element. Resistors act to reduce current flow, and, at the same time, act to lower voltage levels within circuits. - Wikipedia; PROD_ID: RES-07857
R2 R4 = SparkFun-Resistors:10KOHM: 10kΩ resistor A resistor is a passive two-terminal electrical component that implements electrical resistance as a circuit element. Resistors act to reduce current flow, and, at the same time, act to lower voltage levels within circuits. - Wikipedia; PROD_ID: RES-00824
R3 R5-R7 R20 = SparkFun-Resistors:100KOHM: 100kΩ resistor A resistor is a passive two-terminal electrical component that implements electrical resistance as a circuit element. Resistors act to reduce current flow, and, at the same time, act to lower voltage levels within circuits. - Wikipedia; PROD_ID: RES-07828
R8 = SparkFun-Resistors:100OHM: 100Ω resistor A resistor is a passive two-terminal electrical component that implements electrical resistance as a circuit element. Resistors act to reduce current flow, and, at the same time, act to lower voltage levels within circuits. - Wikipedia; PROD_ID: RES-07863
R14 = SparkFun-Resistors:715OHM: 715Ω resistor A resistor is a passive two-terminal electrical component that implements electrical resistance as a circuit element. Resistors act to reduce current flow, and, at the same time, act to lower voltage levels within circuits. - Wikipedia; PROD_ID: RES-07850
R15 = SparkFun-Resistors:240OHM: 240Ω resistor A resistor is a passive two-terminal electrical component that implements electrical resistance as a circuit element. Resistors act to reduce current flow, and, at the same time, act to lower voltage levels within circuits. - Wikipedia; PROD_ID: RES-07849
R18 R19 = SparkFun-Resistors:5.1KOHM; PROD_ID: RES-12083
S1 S2 = SparkFun-Switches:MOMENTARY-SWITCH-SPST: Momentary Switch (Pushbutton) - SPST Normally-open (NO) SPST momentary switches (buttons, pushbuttons). Variants PTH-12MM - 12mm square, through-hole Momentary Pushbutton Switch - 12mm Square <https://www.sparkfun.com/products/9190> (COM-09190) PTH-6.0MM, PTH-6.0MM-KIT - 6.0mm square, through-hole Mini Pushbutton Switch <https://www.sparkfun.com/products/97> (COM-00097) KIT package intended for soldering kit's - only one side of pads' copper is exposed. PTH-RIGHT-ANGLE-KIT - Right-angle, through-hole Right Angle Tactile Button <https://www.sparkfun.com/products/10791> - Used on SparkFun BigTime Watch Kit <https://www.sparkfun.com/products/11734> SMD-12MM - 12mm square, surface-mount Tactile Button - SMD (12mm) <https://www.sparkfun.com/products/12993> (COM-12993) Used on SparkFun PicoBoard <https://www.sparkfun.com/products/11888> SMD-4.5MM - 4.5mm Square Trackball Switch Used on SparkFun Blackberry Trackballer Breakout <https://www.sparkfun.com/products/13169> SMD-4.6MMX2.8MM - 4.60mm x 2.80mm, surface mount Used on SparkFun SAMD21 Mini Breakout <https://www.sparkfun.com/products/13664> SMD-5.2MM, SMD-5.2-REDUNDANT - 5.2mm square, surface-mount Mini Pushbutton Switch - SMD <https://www.sparkfun.com/products/8720> (COM-08720) Used on Arduino Pro Mini <https://www.sparkfun.com/products/11114> REDUNDANT package connects both switch circuits together SMD-6.0X3.5MM - 6.0 x 3.5mm, surface mount Momentary Reset Switch SMD <https://www.sparkfun.com/products/8229> (COM-08229) SMD-6.2MM-TALL - 6.2mm square, surface mount Tactile Button - SMD (6mm) <https://www.sparkfun.com/products/12992> Used on SparkFun Digital Sandbox <https://www.sparkfun.com/products/12651> SMD-RIGHT-ANGLE - Right-angle, surface mount Used on SparkFun Block for Intel® Edison - Arduino <https://www.sparkfun.com/products/13036>; PROD_ID: SWCH-11966; SF_SKU: COM-12992
TP1-TP6 TP8 = SparkFun-Connectors:TEST-POINT: SparkFun Test Points Bare copper test points for troubleshooting or In-Circuit-Testing. These are used by our Production team for verifying production board runs using pogo-pins on test beds. SparkFun Products: SparkFun LSM9DS1 Breakout <https://www.sparkfun.com/products/13284> SparkFun PSOC <https://www.sparkfun.com/products/13714> SparkFun Load Cell Amplifier <https://www.sparkfun.com/products/13879>
U2 = SparkFun-IC-Power:V_REG_AP2127: AP2127 - 300mA CMOS LDO Regulator w/ Enable The AP2127 is CMOS process low dropout linear regulator with enable function, the regulator delivers a guaranteed 300mA (min.) continuous load current. Features Output Voltage Accuracy: ±1.5% Output Current: 300mA (Min.) Foldback Short Current Protection: 50mA Enable Function to Turn ON/OFF VOUT Low Dropout Voltage (3.3V): 250mV (Typ.) @IOUT=600mA Excellent Load Regulation: 0.2%/A (Typ.) Excellent Line Regulation: 0.02%/V (Typ.) Low Quiescent Current: 55μA (Typ.) Low Standby Current: 0.01μA (Typ.) Low Output Noise: 50μVRMS PSRR: 100Hz -65dB, 1kHz -65dB OTSD Protection Stable with 1.0μF Flexible Cap: Ceramic, Tantalum and Aluminum Electrolytic Operation Temperature Range: -40°C to 85°C ESD: MM 400V, HBM 4000V; PROD_ID: VREG-14239
U3 = SparkFun-PowerIC:V_REG_AP2112: AP2112 - 600mA CMOS LDO Regulator w/ Enable The AP2112 is CMOS process low dropout linear regulator with enable function, the regulator delivers a guaranteed 600mA (min.) continuous load current. Features Output Voltage Accuracy: ±1.5% Output Current: 600mA (Min.) Foldback Short Current Protection: 50mA Enable Function to Turn ON/OFF VOUT Low Dropout Voltage (3.3V): 250mV (Typ.) @IOUT=600mA Excellent Load Regulation: 0.2%/A (Typ.) Excellent Line Regulation: 0.02%/V (Typ.) Low Quiescent Current: 55μA (Typ.) Low Standby Current: 0.01μA (Typ.) Low Output Noise: 50μVRMS PSRR: 100Hz -65dB, 1kHz -65dB OTSD Protection Stable with 1.0μF Flexible Cap: Ceramic, Tantalum and Aluminum Electrolytic Operation Temperature Range: -40°C to 85°C ESD: MM 400V, HBM 4000V; PROD_ID: VREG-12457; VALUE: 3.3V
U4 = SparkFun-IC-Microcontroller:SIFIVE_FE310: SiFive FE310 - RISC-V MCU The FE310-G002 is the second Freedom E300 SoC. The FE310-G002 is built around the E31 Core Complex instantiated in the Freedom E300 platform. SparkFun Products: [PRODUCT 1] <[PRODUCT1LINK]>; PROD_ID: IC-14494
U5 = SparkFun-IC-Memory:QSPI32MBIT: Integrated Silicon Solution Inc. IS25LP032D The IS25LP032D Serial Flash memory offers a versatile storage solution with high flexibility and performance in a simplified pin count package. ISSI’s “Industry Standard Serial Interface” Flash is for systems that require limited space, a low pin count, and low power consumption. The device is accessed through a 4-wire SPI Interface consisting of a Serial Data Input (SI), Serial Data Output (SO), Serial Clock (SCK), and Chip Enable (CE#) pins, which can also be configured to serve as multi-I/O (see pin descriptions). Datasheet <http://www.issi.com/WW/pdf/25LP-WP032D.pdf>; PROD_ID: IC-14501
U6 = SparkFun-IC-Comms:MK22FN128VLH10: The Kinetis K22 product family members are optimized for costsensitive applications requiring low-power, USB connectivity, high peripheral integration and processing efficiency with a floating-point unit. These devices share the comprehensive enablement and scalability of the Kinetis family.; PROD_ID: IC-14611
U$16 = SparkFun-Aesthetics:OSHW-LOGO: Open-Source Hardware (OSHW) Logo This logo indicates the piece of hardware it is found on incorporates a OSHW license and/or adheres to the definition of open source hardware found here: http://freedomdefined.org/OSHW
Y1 = SparkFun-Clocks:SITIME-CRYSTAL-32.768KHZ; PROD_ID: XTAL-14578
Y2 = SparkFun-Clocks:RESONATOR-16MHZ: 16MHz Resonator Digikey Example <http://www.digikey.com/product-detail/en/murata-electronics-north-america/CSTCE16M0V53-R0/490-1198-1-ND/584635> Frequency: 16MHz Frequency Stability: ±0.3% Frequency Tolerance: ±0.5% Capacitance: 15pF SparkFun Products SparkFun OpenLog <https://www.sparkfun.com/products/13712> SparkFun MicroView - OLED Arduino Module <https://www.sparkfun.com/products/12923>; PROD_ID: XTAL-08900

## Net classes
1 power: width 0.178 mm

## Board
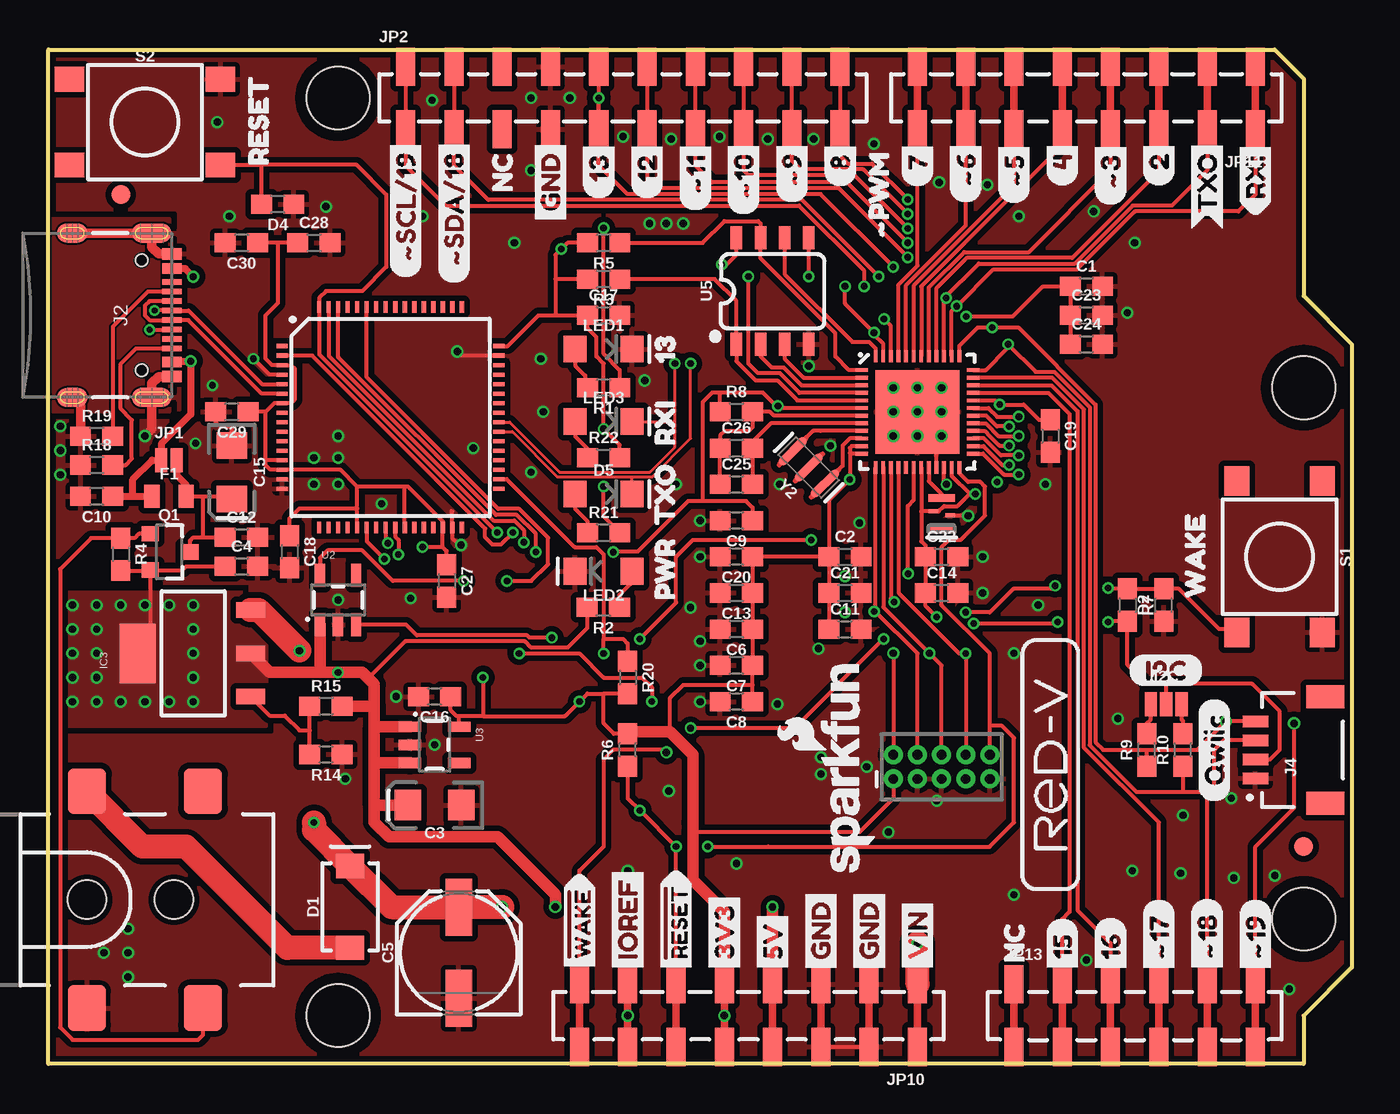
[diagram p2: board, top side]
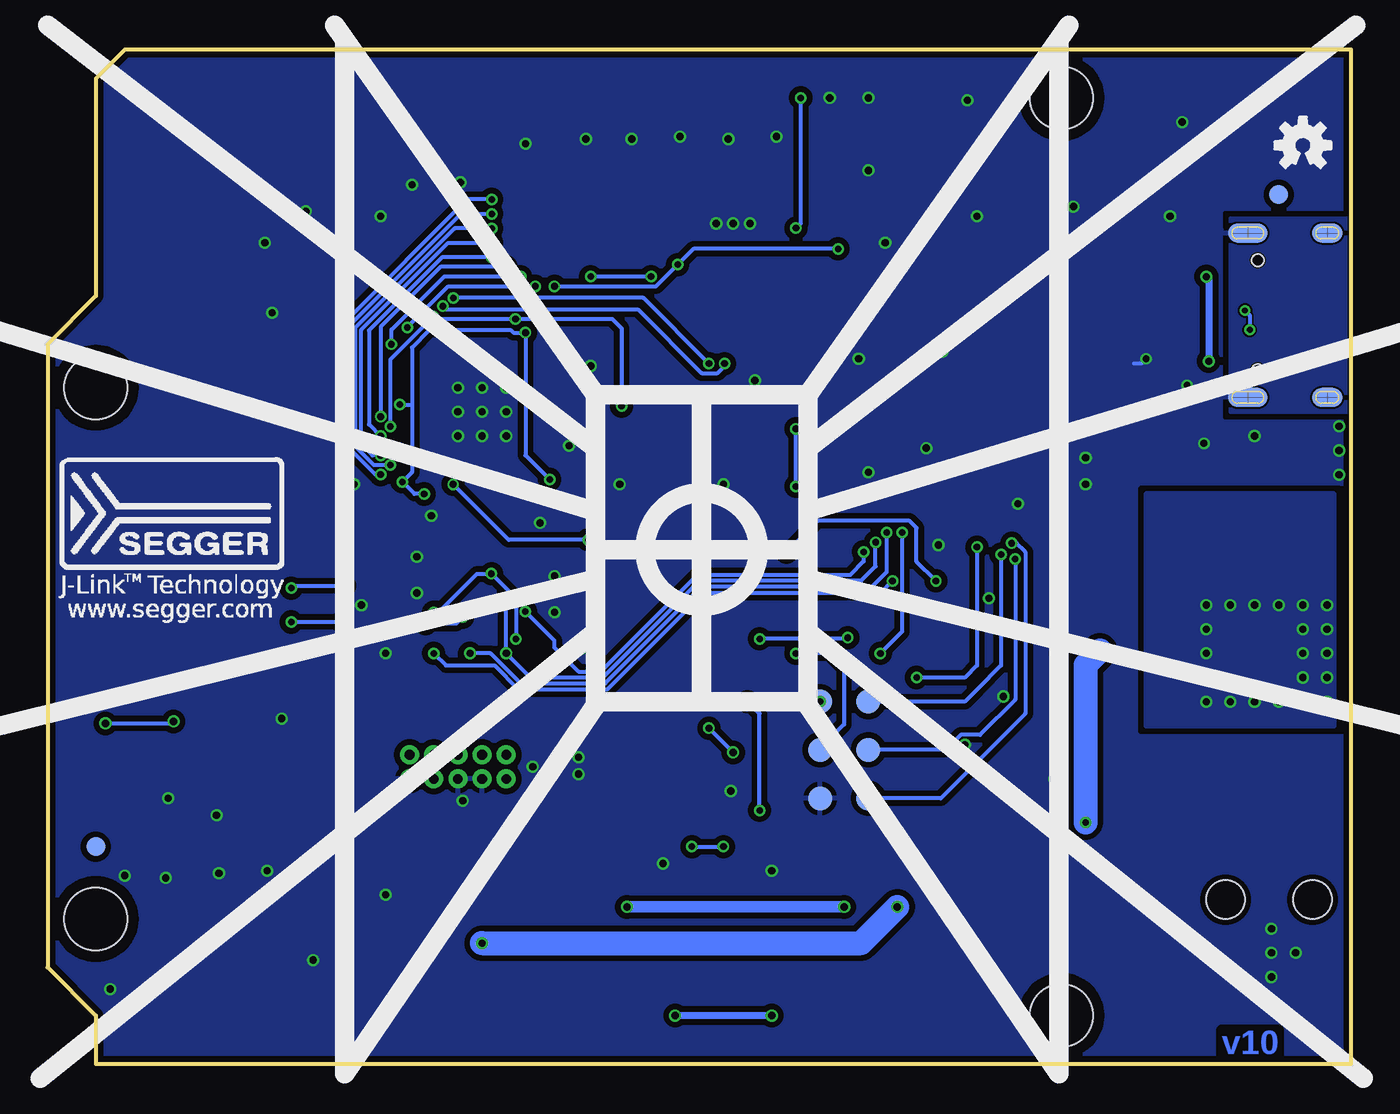
[diagram p3: board, bottom side, seen from below]

Size 68.58 x 53.34 mm. Coordinates in mm from the lower left corner, seen from the top.
Outline: 0,53.34 64.52,53.34 66.04,51.82 66.04,40.39 68.58,37.85 68.58,5.08 66.04,2.54 66.04,0 0,0 0,53.34
Copper layers (1*16): Top 0.035mm / dielectric 1.5mm / Bottom 0.035mm
Design rules "SparkFun-2-layer-FAB-LIMIT": minimum track width 4mil, minimum drill 6mil, track to track 4mil, track to pad 4mil, pad to pad 4mil, via to via 4mil, smd to smd 4mil, copper to edge 4mil, drill to drill 4mil, minimum pad ring 5mil, minimum via ring 5mil, stop-mask expansion 4mil, vias tented up to drill 25mil, thermal gap 10mil
vRestrict: area 0.6,22.4 to 2,30.6; area 5.7,23.1 to 7.4,30.6; area 10,29.3 to 11.4,31.6; area 0.3,13 to 9.4,25

### Footprints (pad centres in the part's own frame; a part is rotated, then mirrored left to right if it is on the bottom)
0603 = smd 1.1 x 1: 1 -0.85,0; 2 0.85,0
EIA3216 = smd 1.4 x 1.6: + 1.4,0; - -1.4,0
PANASONIC_D = smd 3 x 1.4: + 2.4,0; - -2.4,0
SMA-DIODE = smd 1.27 x 1.47: A -2.15,0; C 2.15,0
LED-1206 = smd 1.2 x 1.4: A -1.5,0; C 1.5,0
0805 = smd 0.8 x 1.2: 1 -0.9,0; 2 0.9,0
SMT-JUMPER_3_NO_NO-SILK = smd 0.635 x 1.27: 1 -0.813,0; 2 0,0; 3 0.813,0
SOT223-ALT1 = smd 0.813 x 1.524: 1 -2.271,-3.02; 2 0,-3.02; 3 2.288,-3.02 | smd 3.124 x 1.905: 4 0,2.921
USB-C-16P = smd 0.3 x 1.016: A5 -1.25,0.154; A6 -0.25,0.154; A7 0.25,0.154; A8 1.25,0.154; B5 1.75,0.154; B6 0.75,0.154; B7 -0.75,0.154; B8 -1.75,0.154 | smd 0.6 x 1.016: GND -3.225,0.154; GND2 3.225,0.154 | smd 1 x 2.1: SHLD1 -4.32,-0.915; SHLD2 4.32,-0.915 | smd 1 x 2.1 bottom: SHLD3 -4.32,-0.915; SHLD4 4.32,-0.915 | smd 1 x 1.6: SHLD5 -4.32,-5.095; SHLD8 4.32,-5.095 | smd 1 x 1.6 bottom: SHLD6 -4.32,-5.095; SHLD7 4.32,-5.095 | smd 0.55 x 1.016: VBUS1 -2.45,0.154; VBUS2 2.45,0.154 | hole 0.65: -2.89,-1.445; 2.89,-1.445
POWER_JACK_SMD_OVERPASTE_SUPER_BOMB_DIGITY = smd 2 x 2.4: GND 0,-5.7; P$4 6.1,-5.7; VIN0 0,5.7; VIN1 6.1,5.7 | hole 2.032: 0,0; 4.572,0
JST04_1MM_RA = smd 0.6 x 1.35: 1 -1.5,0; 2 -0.5,0; 3 0.5,0; 4 1.5,0 | smd 1.2 x 2: NC1 2.8,-3.675; NC2 -2.8,-3.675
2X5-PTH-1.27MM-NO_SILK = drill 0.508 pad 1: 1 -2.54,-0.635; 2 -2.54,0.635; 3 -1.27,-0.635; 4 -1.27,0.635; 5 0,-0.635; 6 0,0.635; 7 1.27,-0.635; 8 1.27,0.635; 9 2.54,-0.635; 10 2.54,0.635
SMT-JUMPER_2_NO_NO-SILK = smd 0.635 x 1.27: 1 -0.406,0; 2 0.406,0
1X10_SMD_COMBINED = smd 1 x 2: 1A 0,1.65; 1B 0,-1.65; 2A 2.54,1.65; 2B 2.54,-1.65; 3A 5.08,1.65; 3B 5.08,-1.65; 4A 7.62,1.65; 4B 7.62,-1.65; 5A 10.16,1.65; 5B 10.16,-1.65; 6A 12.7,1.65; 6B 12.7,-1.65; 7A 15.24,1.65; 7B 15.24,-1.65; 8A 17.78,1.65; 8B 17.78,-1.65; 9A 20.32,1.65; 9B 20.32,-1.65; 10A 22.86,1.65; 10B 22.86,-1.65
STAND-OFF = hole 3.302: 0,0
FIDUCIAL-1X2 = smd 1 x 1: 1 0,0
1X08_SMD_COMBINED = smd 1 x 2: 1 0,1.65; 1@2 0,-1.65; 2 2.54,-1.65; 2@2 2.54,1.65; 3 5.08,1.65; 3@2 5.08,-1.65; 4 7.62,-1.65; 4@2 7.62,1.65; 5 10.16,1.65; 5@2 10.16,-1.65; 6 12.7,-1.65; 6@2 12.7,1.65; 7 15.24,1.65; 7@2 15.24,-1.65; 8 17.78,-1.65; 8@2 17.78,1.65
1X06_SMD_STRAIGHT_COMBO = smd 1 x 2: 1 0,-1.65; 1-2 0,1.65; 2 2.54,1.65; 2-2 2.54,-1.65; 3 5.08,-1.65; 3-2 5.08,1.65; 4 7.62,1.65; 4-2 7.62,-1.65; 5 10.16,-1.65; 5-2 10.16,1.65; 6 12.7,1.65; 6-2 12.7,-1.65
SOT23-3 = smd 0.8 x 0.9: 1 -0.95,-1; 2 0.95,-1; 3 0,1.1
TACTILE_SWITCH_SMD_6.2MM_TALL = smd 1.55 x 1.3: A1 -3.975,-2.25; A2 3.975,-2.25; B1 -3.975,2.25; B2 3.975,2.25
PAD.03X.05 = smd 1.27 x 1.27: P$1 0,0
PAD.03X.03 = smd 0.762 x 0.762: P$1 0,0
SOT23-5 = smd 0.55 x 1.2: 1 -0.95,-1.3; 2 0,-1.3; 3 0.95,-1.3; 4 0.95,1.3; 5 -0.95,1.3
QFN-48-.4MMPITCH = smd 0.65 x 0.2: 1 -2.925,2.2; 2 -2.925,1.8; 3 -2.925,1.4; 4 -2.925,1; 5 -2.925,0.6; 6 -2.925,0.2; 7 -2.925,-0.2; 8 -2.925,-0.6; 9 -2.925,-1; 10 -2.925,-1.4; 11 -2.925,-1.8; 12 -2.925,-2.2; 25 2.925,-2.2; 26 2.925,-1.8; 27 2.925,-1.4; 28 2.925,-1; 29 2.925,-0.6; 30 2.925,-0.2; 31 2.925,0.2; 32 2.925,0.6; 33 2.925,1; 34 2.925,1.4; 35 2.925,1.8; 36 2.925,2.2 | smd 0.2 x 0.65: 13 -2.2,-2.925; 14 -1.8,-2.925; 15 -1.4,-2.925; 16 -1,-2.925; 17 -0.6,-2.925; 18 -0.2,-2.925; 19 0.2,-2.925; 20 0.6,-2.925; 21 1,-2.925; 22 1.4,-2.925; 23 1.8,-2.925; 24 2.2,-2.925; 37 2.2,2.925; 38 1.8,2.925; 39 1.4,2.925; 40 1,2.925; 41 0.6,2.925; 42 0.2,2.925; 43 -0.2,2.925; 44 -0.6,2.925; 45 -1,2.925; 46 -1.4,2.925; 47 -1.8,2.925; 48 -2.2,2.925 | smd 4.4 x 4.4: 49 0,0
SO08 = smd 0.6 x 1.2: 1 -1.905,-2.8; 2 -0.635,-2.8; 3 0.635,-2.8; 4 1.905,-2.8; 5 1.905,2.8; 6 0.635,2.8; 7 -0.635,2.8; 8 -1.905,2.8
LQFP-64 = smd 0.6 x 0.22: 1 -5.7,3.75; 2 -5.7,3.25; 3 -5.7,2.75; 4 -5.7,2.25; 5 -5.7,1.75; 6 -5.7,1.25; 7 -5.7,0.75; 8 -5.7,0.25; 9 -5.7,-0.25; 10 -5.7,-0.75; 11 -5.7,-1.25; 12 -5.7,-1.75; 13 -5.7,-2.25; 14 -5.7,-2.75; 15 -5.7,-3.25; 16 -5.7,-3.75; 33 5.7,-3.75; 34 5.7,-3.25; 35 5.7,-2.75; 36 5.7,-2.25; 37 5.7,-1.75; 38 5.7,-1.25; 39 5.7,-0.75; 40 5.7,-0.25; 41 5.7,0.25; 42 5.7,0.75; 43 5.7,1.25; 44 5.7,1.75; 45 5.7,2.25; 46 5.7,2.75; 47 5.7,3.25; 48 5.7,3.75 | smd 0.22 x 0.6: 17 -3.75,-5.8; 18 -3.25,-5.8; 19 -2.75,-5.8; 20 -2.25,-5.8; 21 -1.75,-5.8; 22 -1.25,-5.8; 23 -0.75,-5.8; 24 -0.25,-5.8; 25 0.25,-5.8; 26 0.75,-5.8; 27 1.25,-5.8; 28 1.75,-5.8; 29 2.25,-5.8; 30 2.75,-5.8; 31 3.25,-5.8; 32 3.75,-5.8; 49 3.75,5.8; 50 3.25,5.8; 51 2.75,5.8; 52 2.25,5.8; 53 1.75,5.8; 54 1.25,5.8; 55 0.75,5.8; 56 0.25,5.8; 57 -0.25,5.8; 58 -0.75,5.8; 59 -1.25,5.8; 60 -1.75,5.8; 61 -2.25,5.8; 62 -2.75,5.8; 63 -3.25,5.8; 64 -3.75,5.8
CRYSTAL-SMD-2X1.2MM = smd 0.4 x 1.4: 1 -0.8,0; 3 0.8,0 | smd 0.2 x 0.5: 2 -0.1,-0.45; 4 0.1,0.45
RESONATOR-SMD-3.2X1.3 = smd 0.45 x 1.905: 1 -1.2,0; 2 0,0; 3 1.2,0

### Placement (x,y rotation side)
C1  54.61,40.89 0 top
C2  41.91,26.67 0 top
C3  20.32,13.61 180 top
C4  10.16,26.16 0 top
C5  21.59,5.84 90 top
C6  36.2,22.86 180 top
C7  36.2,20.95 180 top
C8  36.2,19.05 180 top
C9  36.2,28.57 180 top
C10  2.54,29.84 180 top
C11  41.91,22.86 0 top
C12  10.16,27.69 0 top
C13  36.2,24.77 180 top
C14  46.99,24.77 0 top
C15  9.65,31.11 270 top
C16  20.32,19.32 180 top
C17  29.21,39.37 0 top
C18  12.69,26.94 270 top
C19  52.7,33.02 270 top
C20  36.2,26.67 180 top
C21  41.91,24.77 0 top
C22  46.99,26.67 0 top
C23  54.61,39.37 0 top
C24  54.61,37.85 0 top
C25  36.2,30.48 0 top
C26  36.2,32.38 0 top
C27  20.95,25.4 270 top
C28  13.97,43.18 0 top
C29  9.65,34.29 180 top
C30  10.16,43.18 180 top
D1  15.88,8.26 90 top
D2  58.67,24.13 90 top
D4  12.06,45.21 180 top
D5  29.21,29.97 0 top
F1  6.35,29.84 0 top
FRAME1  1,-17 0 top  (outside the outline)
FRAME2  1,-17 0 top  (outside the outline)
I2C  58.8,18.92 0 top
IC3  7.62,21.59 90 top
J2  6.35,39.37 270 top
J3  2.03,8.64 0 top
J4  63.5,16.51 90 top
J5  46.99,15.62 0 top
JP1  6.35,31.75 0 top
JP2  18.8,50.8 0 top
JP3  15.24,2.54 0 top
JP4  66.04,7.62 0 top
JP5  66.04,35.56 0 top
JP6  15.24,50.8 0 top
JP8  66.04,11.43 0 top
JP9  3.81,45.72 0 top
JP10  45.72,2.54 180 top
JP11  63.5,50.8 180 top
JP13  50.8,2.54 0 top
JP15  3.81,45.72 0 bottom
JP16  66.04,11.43 0 bottom
LED1  29.21,37.59 0 top
LED2  29.21,25.91 180 top
LED3  29.21,33.78 0 top
LOGO1  42.04,15.62 90 top
Q1  6.35,26.92 270 top
R1  29.21,35.56 180 top
R2  29.19,24 180 top
R3  29.21,41.27 180 top
R4  3.81,26.8 270 top
R5  29.21,43.18 180 top
R6  30.48,16.51 90 top
R7  56.77,24.13 270 top
R8  36.2,34.29 0 top
R9  57.78,16.51 90 top
R10  59.69,16.51 90 top
R14  14.61,16.27 180 top
R15  14.61,18.81 0 top
R18  2.54,31.5 0 top
R19  2.54,33.02 0 top
R20  30.48,20.32 270 top
R21  29.21,27.94 0 top
R22  29.21,31.88 0 top
S1  64.77,26.67 270 top
S2  5.08,49.53 0 top
TP1  27.94,19.05 0 bottom
TP2  27.94,16.51 0 bottom
TP3  27.94,13.97 0 bottom
TP4  25.4,19.05 0 bottom
TP5  25.4,16.51 0 bottom
TP6  25.4,13.97 0 bottom
TP8  15.24,21.59 0 bottom
U2  15.24,24.4 0 top
U3  20.32,16.78 270 top
U4  45.72,34.29 0 top
U5  38.1,40.64 0 top
U6  18,34 0 top
U$1  [(QWIIC)]  61.34,13.72 90 top
U$2  [#324]  55.88,45.09 90 top
U$3  [#522]  50.8,45.21 90 top
U$4  [#621]  48.26,45.21 90 top
U$8  [SEGGERLOGO#PNG]  62.23,26.67 0 bottom
U$9  [#918]  39.12,45.21 90 top
U$11  [I2C0]  56.77,20.7 0 top
U$14  [#1017]  36.58,44.58 90 top
U$15  [#1116]  34.04,44.83 90 top
U$16  2.54,48.31 0 bottom
U$17  [#1710]  58.42,4.57 90 top
U$18  [#1812]  60.96,4.57 90 top
U$19  [#1911]  63.5,4.57 90 top
U$20  [#RESET2]  33.02,4.45 90 top
U$21  [#SCL#1926]  18.8,41.27 90 top
U$22  [#SDA#1827]  21.34,41.02 90 top
U$23  [#WAKE0]  27.94,4.45 90 top
U$24  [3V33]  35.56,4.57 90 top
U$25  [5V4]  38.1,4.57 90 top
U$26  [158]  53.34,4.57 90 top
U$27  [169]  55.88,4.57 90 top
U$28  [225]  58.42,46.1 90 top
U$29  [423]  53.34,46.1 90 top
U$30  [720]  45.72,46.1 90 top
U$31  [819]  41.66,46.1 90 top
U$32  [1215]  31.5,45.47 90 top
U$33  [1314]  28.96,45.47 90 top
U$34  [GND5]  26.42,43.94 90 top
U$35  [GND5]  40.64,4.57 90 top
U$36  [GND5]  43.18,4.57 90 top
U$37  [IOREF1]  30.48,4.57 90 top
U$38  [NC7]  50.8,4.45 90 top
U$39  [RXI29]  63.5,44.58 90 top
U$40  [TXO28]  60.96,43.81 90 top
U$41  [VIN6]  45.72,4.57 90 top
U$42  [_#PWM30]  43.69,42.16 90 top
U$43  [NC7]  23.88,44.96 90 top
U$45  [133]  32.43,35.94 90 top
U$46  [PWR0]  32.43,23.5 90 top
U$47  [RXI1]  32.43,31.62 90 top
U$48  [TXO2]  32.43,27.43 90 top
U$49  [RESET0]  11.05,46.35 90 top
U$50  [WAKE1]  60.33,23.62 90 top
U$52  [REDFIVE_LOGO#05#PNG]  52.7,15.75 90 top
Y1  46.99,28.96 90 top
Y2  40.01,31.37 135 top

### Tracks (layer width: path | path; a pad name or v marks a point on that pad's centre or on a via)
1.8V  (via drill 0.35)
  Top 0.152: v38.38,34.59 38.38,34.57 38.35,34.54
  Top 0.203: U2.5 14.29,26.61 14.68,27 16.51,27 18.11,25.4 v21.84,25.4 | U4.6 38.41,34.49 38.35,34.54 37.59,35.31 35.31,35.31 | C9.1 37.05,29.25 36.7,29.59 34.42,29.59 | 35.31,35.31 34.92,35.31 34.42,34.8 34.42,29.59 | R8.1 35.34,35.27 35.31,35.31 | v43.96,39.18 44.32,38.82 U4.46 | v48.28,39.31 50.74,39.31 52.32,40.89 C1.1 C23.1 C24.1 | 34.42,29.59 33.66,29.59 31,26.94 29.74,26.94 v29.71,26.91 | U4.30 49.35,34.09 49.91,33.53 v50.54,33.53
  Bottom 0.203: v38.38,34.59 38.38,38.68 38.88,39.18 v43.96,39.18 48.15,39.18 v48.28,39.31 50.55,37.04 v50.55,33.53 v50.54,33.53 | v29.71,26.91 28.06,28.56 23.23,28.56 22.86,28.19 22.86,26.42 v21.84,25.4
3.3V  (via drill 0.35, 0.38)
  Top 0.203: C16.1 21.17,18.6 21.48,18.29 21.59,18.29 | J5.1 44.45,13.97 42.67,12.19 33.91,12.19 | J4.2 64.27,16.01 64.77,16.51 64.77,18.54 63.33,19.98 58.8,19.98 | 58.8,19.98 57.78,19.98 56.77,21 R7.2 55.79,23.28 v55.75,23.24 | 30.48,17.46 R6.2 29.76,17.36 29.21,17.91 29.21,19.47 | JP10.5 v35.56,2.54 | JP10.7 v30.48,2.54 JP10.7@2 | U6.48 24.16,37.75 25.78,39.37 26.67,39.37 | 26.67,39.37 C17.1 28.36,38.7 28.83,38.23 28.83,37.21 29.21,36.83 v29.21,33.4 30.06,32.55 R22.2 | 11.43,34.29 11.89,34.75 U6.7 12.78,34.75 12.95,34.92 12.95,36.58 12.78,36.75 U6.3 11.76,36.75 11.43,37.08 11.43,39.37 12.06,40.01 12.06,43.18 | 11.43,34.29 C29.1 | U6.13 11.43,31.75 | 11.43,31.75 11.43,34.29 | 11.43,31.75 11.43,31.5 11.68,31.25 U6.14 15.37,31.24 16.25,30.36 | U6.21 16.25,29.21 | 16.25,29.21 16.25,30.36 | C18.1 12.69,28.69 13.21,29.21 16.25,29.21 | 18.8,30.36 18.92,30.36 20.75,28.53 U6.30 20.75,27.18 | 18.8,30.36 16.25,30.36 | U6.26 18.75,30.31 18.8,30.36 | U4.11 42.27,32.49 42.16,32.38 42.16,32.13 | U4.12 42.2,32.09 42.16,32.13 | U4.19 45.92,29.06 | 45.92,29.06 45.92,27.49 46.14,27.27 C22.1 C14.1 46.14,24.09 v46.74,23.5 | C2.1 41.06,29.63 v42.16,30.73 42.16,32.13 | 45.92,29.06 Y1.4 46.84,29.06 47.12,29.34 47.83,29.34 48.47,29.97 | U4.47 43.92,37.87 43.43,38.35 v43.43,38.45 41.91,39.98 v41.91,40.89 | U4.23 47.52,30.92 48.47,29.97 | R5.2 27.3,43.18 v26.99,42.86 26.67,42.55 26.67,41.27 | 26.67,41.27 26.67,39.37 | R3.2 26.67,41.27 | 48.47,29.97 v48.77,29.97 | R20.2 29.21,19.47 | 22.86,18.29 27.17,18.29 28.35,19.47 | 22.86,18.29 21.59,18.29 | U3.5 21.62,18.26 21.59,18.29 | C27.1 20.95,26.97 20.75,27.18 | 20.75,27.18 v19.68,27.18
  Top 0.203: v22.86,20.32 22.86,18.29 | C2.1 C20.1 C13.1 C6.1 C7.1 37.05,19.94 | C2.1 C21.1 C11.1 | C8.1 37.05,19.94 | 32.7,17.46 32.7,19.24 33.4,19.94 37.05,19.94 | R21.2 29.21,28.79 v29.21,30.37 | U4.32 49.82,34.89 v50.04,34.67 51.31,34.67 52.11,33.87 C19.1 | v53.09,23.24 53,23.15 v48.68,23.15 | C28.1 12.06,43.18 | 12.06,43.18 C30.1 | v35.43,42.04 35.69,42.04 36.2,42.55 U5.8 | I2C.2 58.8,19.98 | 28.35,19.47 29.21,19.47 | TP1.P$1 28.35,19.47
  Top 0.381: v35.56,2.54 JP10.5@2
  Top 0.61: 30.48,17.46 32.7,17.46 33.91,16.26 33.91,12.7 33.91,12.19 33.91,9.65 35.56,8 JP10.5@2
  Bottom 0.203: v48.77,29.97 49.28,29.97 v49.91,30.61 49.4,31.11 49.4,34.67 | v19.68,27.18 19.68,20.95 20.32,20.32 v22.86,20.32 | v42.16,30.73 43.43,32 v43.43,38.45 44.07,38.45 44.22,38.61 44.23,38.6 48.47,38.6 49.4,37.67 49.4,34.67 | v29.21,30.37 v29.21,33.4 | v26.99,42.86 34.61,42.86 v35.43,42.04 36.58,40.89 v41.91,40.89 | v46.74,23.5 47.08,23.15 v48.68,23.15 | v50.04,34.67 49.4,34.67 | v55.75,23.24 v53.09,23.24
  Bottom 0.381: v30.48,2.54 v35.56,2.54
  other vias: 27.94,19.05
5V  (via drill 0.35, 0.38)
  Top 0.203: R4.2 5.32,25.95 Q1.2 | Q1.2 7.05,25.97 7.24,26.16 C4.1 | Q1.2 5.35,22.24 IC3.4 | 17.21,17.73 17.14,17.67 | 14.29,20.65 14.35,20.59 | JP10.4@2 JP10.4 | 16.83,20.27 18.78,22.23 25.07,22.23 25.4,21.89 27.32,21.89 28.34,22.92 R2.2
  Top 0.61: U3.1 17.21,17.73 | 17.14,18.81 R15.2 | C3.+ 17.14,13.61 | 17.14,13.61 17.14,15.76 | 17.14,15.76 17.14,17.67 17.14,18.81 | U2.1 14.29,20.65 | 17.14,18.81 17.14,19.95 16.83,20.27 16.51,20.59 v15.24,20.59 14.35,20.59 11.64,20.59 IC3.2 | U3.3 17.21,15.83 17.14,15.76 | JP10.4 v38.1,8.26 | 17.14,13.61 17.14,12.72 17.92,11.94 23.62,11.94 26.67,8.89 v26.67,8.26
  Bottom 0.61: v38.1,8.26 v26.67,8.26 | v15.24,20.59 TP8.P$1
  other vias: 2.54,22.86 2.54,21.59 2.54,20.32 2.54,19.05 3.81,19.05 5.08,19.05 6.35,19.05 7.62,19.05 7.62,20.32 7.62,21.59 7.62,22.86 7.62,24.13 6.35,24.13 5.08,24.13 3.81,24.13 2.54,24.13 1.27,24.13 1.27,22.86 1.27,21.59 1.27,20.32 1.27,19.05
  pour Bottom (isolate 0.305, no thermals): 0.89,29.97 10.79,29.97 10.79,20.32 10.79,17.78 0.89,17.78
  pour Top (isolate 0.305, no thermals): 0.89,17.78 0.89,24.77 11.43,24.77 11.43,17.78
!RESET  (via drill 0.35)
  Top 0.203: S2.A2 11.21,47.28 | 49.53,17.78 49.53,18.41 49.53,21.59 46.99,24.13 46.99,27.18 47.37,27.56 48.01,27.56 49.28,28.83 49.28,30.35 49.02,30.61 48.39,30.61 47.92,31.07 U4.24 | R6.1 30.48,13.97 v31.11,13.34 v33.02,11.43 JP10.6 JP10.6@2 | D4.2 11.21,47.28 | 11.21,47.28 16.22,47.28 17.78,45.72 17.78,41.91 16.51,40.64 14.61,40.64 14.25,40.28 U6.64 14.25,37.31 v23.62,27.94 | J5.10 49.53,17.78 | v24.77,21.59 27.94,21.59 29.21,20.32 31.24,20.32 31.75,19.81 v31.75,19.05 | v34.68,11.43 37.87,11.43 37.88,11.42 49.52,11.42 50.8,12.7 50.8,17.14 50.16,17.78 49.53,17.78 | v34.68,11.43
  Bottom 0.203: v31.11,13.34 31.11,18.41 v31.75,19.05 | v23.62,27.94 23.62,22.73 v24.77,21.59 | v34.68,11.43 v33.02,11.43
!WAKE  (via drill 0.35, 0.38)
  Top 0.203: U4.18 45.52,29.64 45.21,29.34 45.21,25.79 v45.23,25.78 | v32.51,16.38 32.38,16.51 29.72,16.51 29.21,16 29.21,11.43 27.94,10.16 JP10.8 JP10.8@2 | S1.A2 62.35,22.86 61.59,22.86 59.48,24.98 D2.2 R7.1 55.79,24.98 v55.75,25.02 | v48.26,23.75 49.53,23.75 50.76,24.98 52.79,24.98 v52.96,25.15 | v43.94,22.35 39.24,17.65 v33.78,17.65
  Bottom 0.203: v33.78,17.65 v32.51,16.38 | v43.94,22.35 43.94,24.5 v45.23,25.78 45.24,25.77 45.99,25.77 48.01,23.75 v48.26,23.75 | v52.96,25.15 55.63,25.15 v55.75,25.02
CORE_ENABLE  (via drill 0.35)
  Top 0.203: v31.11,22.35 33.02,24.26 33.02,26.67 33.91,27.56 v40.13,27.56 | v47.24,30.48 47.12,30.6 U4.22 | v26.48,22.41 25.4,22.41 25.34,22.41 25.31,22.41 25.2,22.53 19.38,22.53 18.81,23.1 U2.3
  Bottom 0.203: v31.11,22.35 26.54,22.35 v26.48,22.41 | v40.13,27.56 44.32,27.56 v47.24,30.48
D+  (via drill 0.3)
  Top 0.203: U6.5 11.24,35.75 7.37,39.62 J2.A6 v5.59,39.62 | v5.33,38.61 6.49,38.61 J2.B6
  Bottom 0.203: v5.59,39.62 5.33,39.37 v5.33,38.61
D-
  Top 0.203: U6.6 11.23,35.25 7.36,39.12 J2.A7 5.33,39.12 5.08,39.37 5.08,39.88 5.32,40.12 J2.B7
DBG_RESET  (via drill 0.35)
  Top 0.203: 29.21,22.35 29.21,26.8 28.83,27.18 27.69,27.18 24.11,30.75 U6.34 | R20.1 30.48,22.1 30.23,22.35 29.72,22.35 29.21,22.35 | v29.21,21.59 29.21,22.35
  Bottom 0.203: v29.21,21.59 27.43,21.59 26.67,20.83 26.67,17.86 27.94,16.59 TP2.P$1
DBG_SWDCLK  (via drill 0.35)
  Top 0.203: U6.22 16.75,27.47 v17.67,26.56
  Bottom 0.203: v17.67,26.56 17.67,19.16 19.53,17.3 20.54,17.3 21.33,16.51 TP5.P$1
DBG_SWDIO  (via drill 0.35)
  Top 0.203: U6.25 18.25,27.72 18.41,27.56 v18.41,26.8
  Bottom 0.203: v18.41,26.8 18.41,20.95 19.68,19.68 20.32,19.05 TP4.P$1
DBG_SWO  (via drill 0.35)
  Top 0.203: U6.24 17.75,27.38 v17.86,27.38
  Bottom 0.203: v17.86,27.38 17.6,27.38 17.14,26.92 17.14,18.41 21.59,13.97 TP6.P$1
GND  (via drill 0.35, 0.38)  (4 unrouted)
  Top 0.152: 5.43,43.53 J2.SHLD1 5.08,43.69
  Top 0.203: JP10.2 JP10.2@2 JP10.3 | U6.47 21.73,37.25 v21.51,37.47 | U6.4 11.63,36.25 v10.79,37.08 | C29.2 8.8,33.74 9.02,33.53 9.53,33.53 9.65,33.4 C15.- | 21.21,29.08 21.25,29.04 U6.31 21.25,27.64 21.46,27.43 | U4.21 46.72,32.75 v46.99,33.02 | v48.39,28.83 48.36,28.86 Y1.2
  Top 0.508: v5.08,33.02 5.43,33.38 J2.SHLD4 5.43,35.79 5.79,36.15 J2.GND2 | J2.GND 5.79,42.59 5.43,42.95 J2.SHLD1 | J2.SHLD6 5.08,43.69 | J2.SHLD8 1.69,34.62 R19.1
  Bottom 0.203: v10.79,37.08 11.05,36.83 11.43,36.83
  other vias: 45.72,35.56 46.99,35.56 46.99,34.29 45.72,34.29 44.45,34.29 44.45,35.56 44.45,33.02 45.72,33.02 8.89,49.53 52.45,30.48 52.07,24.13 49.15,26.67 33.78,24 34.29,26.67 33.02,30.48 31.37,35.94 56.77,39.5 57.15,43.18 15.24,33.02 13.97,30.48 46.74,13.84 43.05,15.62 0.64,32.26 15.62,15 20.32,16.78 18.29,19.32 15.24,24.4 19.05,24.5 25.4,46.99 24.51,43.18 19.68,44.58 9.53,44.58 62.23,13.97 59.69,13.08 50.8,8.89 50.8,21.59 40.64,15.24 44.2,12.19 30.48,10.16 49.15,24.77 40.51,21.84 34.29,22.23 34.29,20.95 34.29,19.05 38.35,18.92 40.64,16.13 2.92,5.84 4.19,4.57 4.19,5.84 4.19,7.11 0.64,33.53 0.64,30.99 15.24,30.48 13.97,31.88 15.24,31.88 17.53,29.46 8.64,35.69 7.75,32.64 38.48,30.48 41.15,32.51 34.29,28.57 21.72,27.29 41.91,23.75 41.91,25.65 42.67,28.45 40.01,36.7 25.4,50.8 27.43,50.8 54.61,5.46 57.02,10.16 59.56,10.03 62.36,9.78 64.52,9.91 54.99,44.83 51.05,44.58 49.4,46.23 46.86,46.35 43.43,48.39 40.26,48.64 37.85,48.64 35.31,48.77 32.77,48.64 30.23,48.77 33.4,44.2 32.51,44.2 31.62,44.2 25.91,37.08 26.04,34.29 25.4,31.11 22.35,32.38 14.61,45.09 20.19,50.67 32.64,14.35 65.28,3.94 56.26,18.16 36.2,10.54
  pour Top (isolate 0.305, rank 2): 0,53.34 68.58,53.34 68.58,0 0,0
  pour Bottom (isolate 0.305, rank 2): 0,53.34 68.58,53.34 68.58,0 0,0
INSERT
  Top 0.203: Q1.1 4.76,27.87 4.53,27.65 R4.1 2.25,27.65 0.62,26.02 0.62,1.92 1.27,1.27 7.87,1.27 8.13,1.53 J3.P$4
IO0  (via drill 0.35)
  Top 0.203: JP2.10A JP2.10B 41.66,47.75 42.06,47.35 43.33,47.35 v45.21,45.47 | U4.25 49.17,32.09 50.27,30.99 v51.05,30.99
  Bottom 0.203: v51.05,30.99 51.33,30.99 52.98,32.64 52.98,38.98 46.5,45.47 v45.21,45.47
IO1  (via drill 0.35)
  Top 0.203: JP2.9A JP2.9B 39.12,47.5 39.57,47.04 42.88,47.04 v45.21,44.7 | U4.26 49.2,32.49 50.19,31.5 v50.55,31.5
  Bottom 0.203: v50.55,31.5 51.41,31.5 52.68,32.77 52.68,38.86 46.83,44.7 v45.21,44.7
IO2  (via drill 0.35)
  Top 0.203: JP2.8A JP2.8B 36.58,46.99 36.83,46.74 42.42,46.74 v45.21,43.94 | U4.27 49.23,32.89 50.12,32 v51.05,32
  Bottom 0.203: v51.05,32 51.48,32 52.38,32.89 52.38,38.73 47.16,43.94 v45.21,43.94
IO9
  Top 0.203: U4.33 52.62,35.29 53.72,34.19 53.72,8 53.34,7.62 JP13.2
IO10
  Top 0.203: U4.34 52.78,35.69 54.14,34.33 54.14,8.09 55.88,6.35 55.88,0.86 JP13.3
IO11
  Top 0.203: U4.35 52.81,36.09 54.48,34.42 54.48,16.64 58.42,12.7 JP13.4
IO18
  Top 0.203: JP11.3@2 JP11.3 58.42,46.95 53.87,42.39 48.31,42.39 46.8,40.88 46.72,40.8 U4.40
IO19
  Top 0.203: JP11.4 JP11.4@2 55.88,46.99 51.59,42.7 48.19,42.7 46.32,40.83 U4.41
IO20
  Top 0.203: U4.42 45.92,40.89 53.34,48.31 JP11.5 JP11.5@2
IO21
  Top 0.203: JP11.6 JP11.6@2 50.8,46.2 45.52,40.92 U4.43
IO22
  Top 0.203: JP11.7@2 JP11.7 48.26,44.09 45.12,40.95 U4.44
IO23
  Top 0.203: JP11.8 JP11.8@2 45.72,41.98 44.72,40.98 U4.45
N$1
  Top 0.203: R1.2 28.24,35.68 28.24,36.2 27.71,36.73 LED1.A
N$2
  Top 0.203: R2.1 30.04,24.66 30.63,25.25 30.63,25.83 LED2.A
N$3
  Top 0.203: U4.10 42.16,32.89 41.78,32.51 41.78,31.45 Y2.1
N$4
  Top 0.203: I2C.3 59.61,18.11 59.69,18.03 R10.2
N$5
  Top 0.203: R9.2 57.78,17.91 57.99,18.11 I2C.1
N$6
  Top 0.203: LED3.A 27.71,33 28.36,32.35 R22.1
N$7
  Top 0.203: U4.9 40.64,33.29 | 40.64,33.29 40.23,33.29 | 40.64,33.29 40.23,33.29 | 40.23,33.29 Y2.3
N$8
  Top 0.203: U4.20 46.32,30.64 46.99,29.97 Y1.3
N$10
  Top 0.203: C25.2 C26.2 37.05,32.73 38.01,33.69 U4.8
N$12
  Top 0.203: J2.B5 4.6,37.62 3.81,36.83 3.81,34.45 4.4,33.86 4.4,31.83 4.06,31.5 R18.2
N$13
  Top 0.203: D5.A 27.71,29.19 28.36,28.54 R21.1
N$15
  Top 0.203: R14.2 13.76,17.54 | 13.76,17.54 R15.1 | 13.76,17.54 13.21,17.54 12.43,18.32 11.64,18.32 IC3.1
N$17
  Top 0.203: R19.2 3.39,38.78 5.23,40.62 J2.A5
PLL_AVDD
  Top 0.203: U4.7 38.17,34.09 37.97,34.29 R8.2 37.05,33.49 36.83,33.27 35.56,33.27 35.34,33.06 C26.1 C25.1
PWRIN
  Top 1.27: J3.VIN0 4.94,11.43 7.25,11.43 12.57,6.11 D1.A
QSPI_0  (via drill 0.35)
  Top 0.203: U4.4 39.51,35.29 38.48,36.32 37.34,36.32 36.83,36.83 v36.83,41.4 | v40.01,41.4 U5.5
  Bottom 0.203: v36.83,41.4 v40.01,41.4
QSPI_1
  Top 0.203: U5.2 37.47,37.21 38.05,36.63 38.68,36.63 39.62,35.69 U4.3
QSPI_2
  Top 0.203: U5.3 38.73,37.08 39.73,36.09 U4.2
QSPI_3
  Top 0.203: R5.1 34.42,43.18 35.56,44.32 37.34,44.32 37.47,44.2 U5.7 37.47,42.37 41.4,38.43 41.4,37.21 42.12,36.49 U4.1
QSPI_CS
  Top 0.203: U4.5 39.41,34.89 38.35,35.94 37.21,35.94 36.2,36.96 U5.1 36.2,40.13 35.05,41.27 R3.1
QSPI_SCK
  Top 0.203: U5.6 38.73,41.53 42.29,37.97 43.18,37.97 43.52,37.63 U4.48
RXI  (via drill 0.35)
  Top 0.152: U6.40 24.27,33.75 26.9,31.11 31.64,31.11 32.96,32.43 32.96,33.78 | 32.96,33.78 v32.96,36.83 | LED3.C 32.96,33.78
  Top 0.203: JP11.1@2 JP11.1 63.5,45.72 62.61,44.83 57.16,44.83 54.12,41.78 49.72,41.78 v47.78,39.85 47.52,39.58 U4.38
  Bottom 0.203: v47.78,39.85 47.62,39.68 37.52,39.68 34.16,36.32 33.32,36.32 32.96,36.68 v32.96,36.83
SCL  (via drill 0.35, 0.38)
  Top 0.203: J4.4 v61.95,18.01 60.45,16.51 58.63,16.51 57.78,16.51 | v65.53,17.91 65.53,13.46 63.5,11.43 JP13.6 | JP2.1A JP2.1B 18.8,47.24 20.9,45.14 39.5,45.14 42.93,41.71 v42.93,40.89 | U4.37 47.92,37.76 48.9,38.73 v49.66,38.73 51.03,38.73 55.09,34.67 55.09,16.92 55.5,16.51 57.78,16.51 | R9.1 57.78,16.51
  Bottom 0.203: v65.53,17.91 62.05,17.91 v61.95,18.01 | v42.93,40.89 47.5,40.89 v49.66,38.73
SDA  (via drill 0.35)
  Top 0.203: J4.3 61.84,17.01 61.34,16.51 61.34,14.61 61.05,14.31 | JP2.2A JP2.2B 21.34,47.24 23.14,45.44 39.65,45.44 v43.69,41.4 | U4.36 49.32,36.49 50.49,37.66 v50.49,37.85 51.94,36.4 52.94,36.4 54.79,34.54 54.79,16.76 57.24,14.31 59.69,14.31 | R10.1 59.69,14.31 | 59.69,14.31 61.05,14.31 | 61.05,14.31 60.96,14.22 JP13.5
  Bottom 0.203: v43.69,41.4 47.7,41.4 50.49,38.62 v50.49,37.85
SHLD
  pour Bottom: 0,44.45 6.35,44.45 6.35,34.29 0,34.29
  pour Top: 0,44.45 6.35,44.45 6.35,34.29 0,34.29
SPI_MISO  (via drill 0.35)
  Top 0.203: JP2.6A JP2.6B 31.5,46.3 31.75,46.05 41.58,46.05 v45.21,42.42 | U4.29 49.31,33.69 49.98,33.02 v51.05,33.02
  Bottom 0.203: v51.05,33.02 51.66,33.63 51.66,38.58 47.83,42.42 v45.21,42.42
SPI_MOSI  (via drill 0.35)
  Top 0.203: JP2.7B 34.04,49.53 | 34.04,49.53 34.04,51.82 34.29,52.07 34.29,52.2 JP2.7A | U4.28 49.26,33.29 49.53,33.02 50.04,32.51 v50.55,32.51 | 34.04,49.53 34.04,47.24 34.92,46.35 42.04,46.35 v45.21,43.18
  Bottom 0.203: v50.55,32.51 51.56,32.51 52.07,33.02 52.07,38.6 47.49,43.18 v45.21,43.18
SPI_SCK  (via drill 0.35)
  Top 0.203: JP2.5A v28.96,50.8 | v28.96,50.8 JP2.5B | R1.1 30.06,36.49 29.21,37.34 v29.21,43.95 | U4.31 49.46,34.49 49.91,34.03 v51.05,34.03 v51.05,34.04 | v28.96,50.8 28.96,47.27 30.48,45.74 40.64,45.74 40.64,45.72 v44.45,41.91
  Bottom 0.203: v29.21,43.95 28.96,44.2 v28.96,50.8 | v51.05,34.04 51.05,38.76 47.9,41.91 v44.45,41.91
TCK  (via drill 0.35)
  Top 0.203: J5.4 45.72,21.59 43.52,23.79 | 43.52,23.79 U4.13 | v25.65,26.92 25.65,27.87 24.64,28.88 23.54,28.88 15.25,37.17 U6.62 | 43.52,23.79 v43.44,23.79
  Bottom 0.203: v25.65,26.92 25.65,26.42 26.36,25.7 34.42,25.7 39.5,20.62 40.64,20.62 41.91,21.89 41.91,22.26 v43.44,23.79
TDI  (via drill 0.35)
  Top 0.203: U4.16 44.72,24.78 47.91,21.59 v48.26,21.59 J5.8 | v24.13,25.4 25.4,25.4 26.29,26.29 26.29,27.66 24.77,29.18 23.67,29.18 16.75,36.1 U6.59
  Bottom 0.203: v48.26,21.59 47.62,20.95 45.07,20.95 43.83,19.71 39.12,19.71 34.04,24.79 24.74,24.79 v24.13,25.4
TDO  (via drill 0.35, 0.38)
  Top 0.203: U4.14 43.92,24.02 v46.35,21.59 46.99,20.95 J5.6 | v24.43,27.94 23.8,27.3 23.37,27.3 22.99,27.69 22.99,28.14 13.88,37.25 U6.2
  Bottom 0.203: v24.43,27.94 24.43,25.86 25.2,25.09 34.16,25.09 39.24,20.02 43.7,20.02 45.28,21.59 v46.35,21.59
TMS  (via drill 0.35, 0.38)
  Top 0.203: v44.49,24.3 44.32,24.47 U4.15 | v44.45,21.59 J5.2 | U6.63 14.75,37.24 23.42,28.57 24.51,28.57 25.02,28.07 v25.02,27.43
  Bottom 0.203: v44.49,24.3 44.49,21.63 v44.45,21.59 43.18,20.32 39.37,20.32 34.29,25.4 25.78,25.4 25.02,26.16 v25.02,27.43
TXO  (via drill 0.35)
  Top 0.152: v47.23,40.29 47.14,40.29 47.12,40.26 | U6.39 24.41,33.25 26.8,30.86 30.73,30.86 | 30.73,30.86 31.75,30.86 33.78,32.89 v33.78,36.83 | D5.C 30.71,30.84 30.73,30.86
  Top 0.203: JP11.2 JP11.2@2 60.96,46.99 59.11,45.14 57.04,45.14 53.99,42.09 48.95,42.09 47.12,40.26 U4.39
  Bottom 0.203: v33.78,36.83 37.24,40.29 v47.23,40.29
USBVCC
  Top 0.203: Q1.3 7.45,27.52 7.62,27.69 | F1.2 8.13,29.84 | 7.62,27.69 8.13,27.69 | 8.13,27.69 C12.1 | 7.62,27.69 | 8.13,29.84 8.13,29.21 8.13,28.57 8.13,27.69 | 8.13,29.84 9.52,29.84 C15.+
  Top 0.381: JP1.2 6.76,30.96 7.25,30.47 F1.2
VIN  (via drill 0.35, 0.38)
  Top 0.203: JP10.1 JP10.1@2
  Top 1.27: JP10.1@2 v45.72,6.35 | v23.88,8.26 23.86,8.24 C5.+ 18.05,8.24 D1.C 13.97,12.31 v13.97,12.7 | IC3.3 11.06,23.88 v13.21,21.73 | JP10.1@2 v45.72,6.35 | JP10.1@2 v45.72,6.35 | JP10.1@2 v45.72,6.35 | JP10.1@2 v45.72,6.35
  Bottom 1.27: v13.21,21.73 13.97,20.97 v13.97,12.7 | v23.88,8.26 25.78,6.35 v45.72,6.35
VUSB  (via drill 0.38)
  Top 0.381: C10.1 4.45,29.84 | 4.45,29.84 F1.1 | 7.49,36.92 J2.VBUS2 | v7.62,41.4 7.2,41.82 J2.VBUS1 | 7.49,36.92 7.49,34.16 5.94,32.61 JP1.1 5.46,31.75 4.45,30.73 4.45,29.84 | v7.49,36.96 7.49,36.92
  Bottom 0.381: v7.49,36.96 7.49,41.27 v7.62,41.4

### Text on the board
Bottom: v10
Measures: Units in inches
tDocu: A. England | Based on Arduino by: M. Banzi, D. Cuartielles, / T. Igoe, G. Martino, D. Mellis
214bmp: D:/SmartProjects/Snc/a4_bn_logo2.bmp